# EAGLE design Vectr (EAGLE 6.3)

## Sheet 1 of 3: Analog
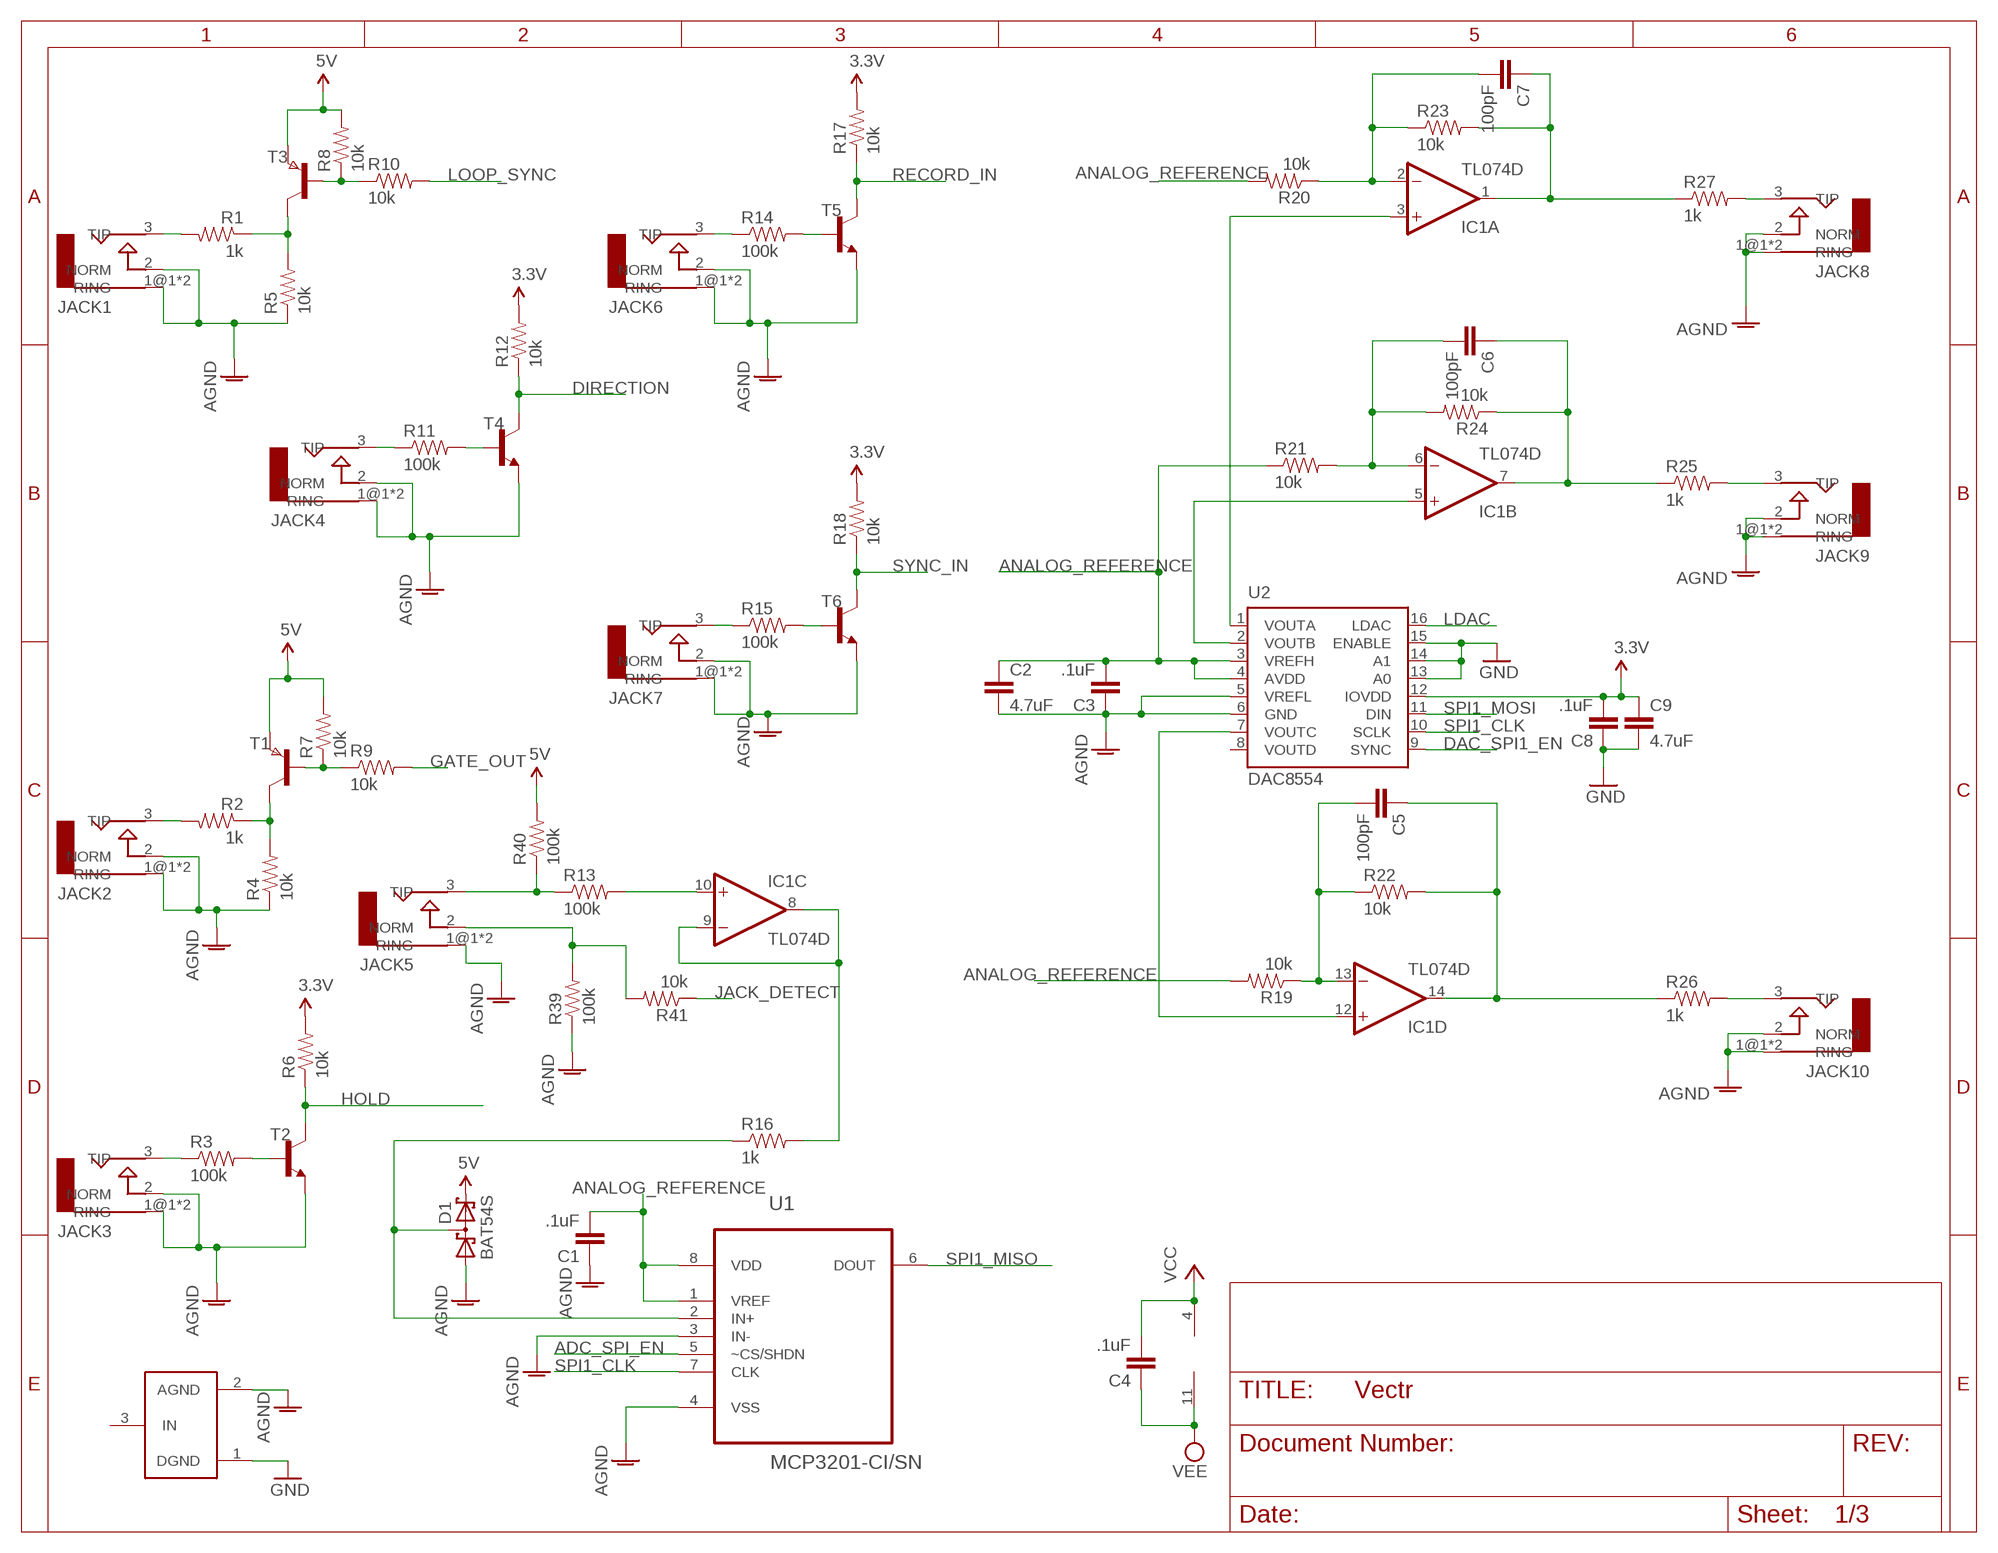
[diagram p0: schematic, sheet 1]

### Parts
C1  .1uF  CAP0402-CAP  [0402-CAP]
C2  4.7uF  CAP0805  [0805]
C3  .1uF  CAP0402-CAP  [0402-CAP]
C4  .1uF  CAP0402-CAP  [0402-CAP]
C5  100pF  CAP0402-CAP  [0402-CAP]
C6  100pF  CAP0402-CAP  [0402-CAP]
C7  100pF  CAP0402-CAP  [0402-CAP]
C8  .1uF  CAP0402-CAP  [0402-CAP]
C9  4.7uF  CAP0805  [0805]
D1  BAT54S  [SOT23]
GND_CONNECT  GND_CONNECT  [GND_CONNECT]
IC1  TL074D  [SO14]
JACK1  AUDIO-JACKERTHENVAR  [ERTHENVAR-JACK]
JACK2  AUDIO-JACKERTHENVAR  [ERTHENVAR-JACK]
JACK3  AUDIO-JACKERTHENVAR  [ERTHENVAR-JACK]
JACK4  AUDIO-JACKERTHENVAR  [ERTHENVAR-JACK]
JACK5  AUDIO-JACKERTHENVAR  [ERTHENVAR-JACK]
JACK6  AUDIO-JACKERTHENVAR  [ERTHENVAR-JACK]
JACK7  AUDIO-JACKERTHENVAR  [ERTHENVAR-JACK]
JACK8  AUDIO-JACKERTHENVAR  [ERTHENVAR-JACK]
JACK9  AUDIO-JACKERTHENVAR  [ERTHENVAR-JACK]
JACK10  AUDIO-JACKERTHENVAR  [ERTHENVAR-JACK]
R1  1k  RESISTOR0402-RES  [0402-RES]
R2  1k  RESISTOR0402-RES  [0402-RES]
R3  100k  RESISTOR0402-RES  [0402-RES]
R4  10k  RESISTOR0402-RES  [0402-RES]
R5  10k  RESISTOR0402-RES  [0402-RES]
R6  10k  RESISTOR0402-RES  [0402-RES]
R7  10k  RESISTOR0402-RES  [0402-RES]
R8  10k  RESISTOR0402-RES  [0402-RES]
R9  10k  RESISTOR0402-RES  [0402-RES]
R10  10k  RESISTOR0402-RES  [0402-RES]
R11  100k  RESISTOR0402-RES  [0402-RES]
R12  10k  RESISTOR0402-RES  [0402-RES]
R13  100k  RESISTOR0402-RES  [0402-RES]
R14  100k  RESISTOR0402-RES  [0402-RES]
R15  100k  RESISTOR0402-RES  [0402-RES]
R16  1k  RESISTOR0402-RES  [0402-RES]
R17  10k  RESISTOR0402-RES  [0402-RES]
R18  10k  RESISTOR0402-RES  [0402-RES]
R19  10k  RESISTOR0402-RES  [0402-RES]
R20  10k  RESISTOR0402-RES  [0402-RES]
R21  10k  RESISTOR0402-RES  [0402-RES]
R22  10k  RESISTOR0402-RES  [0402-RES]
R23  10k  RESISTOR0402-RES  [0402-RES]
R24  10k  RESISTOR0402-RES  [0402-RES]
R25  1k  RESISTOR0402-RES  [0402-RES]
R26  1k  RESISTOR0402-RES  [0402-RES]
R27  1k  RESISTOR0402-RES  [0402-RES]
R39  100k  RESISTOR0402-RES  [0402-RES]
R40  100k  RESISTOR0402-RES  [0402-RES]
R41  10k  RESISTOR0402-RES  [0402-RES]
T1  PNPSOT23  [SOT-23]
T2  TRANSISTOR_NPNSOT23  [SOT23]
T3  PNPSOT23  [SOT-23]
T4  TRANSISTOR_NPNSOT23  [SOT23]
T5  TRANSISTOR_NPNSOT23  [SOT23]
T6  TRANSISTOR_NPNSOT23  [SOT23]
U1  MCP3201-CI/SN  [SOIC127P600X175-8N]
U2  DAC8554  [PW_R-PDSO-G16]

### Nets
3.3V: C8.2 C9.1 R6.2 R12.2 R17.2 R18.2 U2.12(IOVDD) ; also sheet 2,3
5V: D1.2(C2) R7.2 R8.2 R40.2 T1.2(E) T3.2(E) ; also sheet 2
ADC_SPI_EN: U1.5(~CS/SHDN) ; also sheet 3
AGND: C1.1 C2.2 C3.1 D1.1(A1) GND_CONNECT.2(AGND) JACK1.1@1(RING) JACK1.1@2(RING) JACK1.2(NORM) JACK2.1@1(RING) JACK2.1@2(RING) JACK2.2(NORM) JACK3.1@1(RING) JACK3.1@2(RING) JACK3.2(NORM) JACK4.1@1(RING) JACK4.1@2(RING) JACK4.2(NORM) JACK5.1@1(RING) JACK5.1@2(RING) JACK6.1@1(RING) JACK6.1@2(RING) JACK6.2(NORM) JACK7.1@1(RING) JACK7.1@2(RING) JACK7.2(NORM) JACK8.1@1(RING) JACK8.1@2(RING) JACK8.2(NORM) JACK9.1@1(RING) JACK9.1@2(RING) JACK9.2(NORM) JACK10.1@1(RING) JACK10.1@2(RING) JACK10.2(NORM) R4.1 R5.1 R39.1 T2.2(E) T4.2(E) T5.2(E) T6.2(E) U1.3(IN-) U1.4(VSS) U2.5(VREFL) U2.6(GND) ; also sheet 2
ANALOG_REFERENCE: C1.2 C2.1 C3.2 R19.2 R20.2 R21.1 U1.1(VREF) U1.8(VDD) U2.3(VREFH) U2.4(AVDD) ; also sheet 2
DAC_SPI1_EN: U2.9(SYNC) ; also sheet 3
DIRECTION: R12.1 T4.3(C) ; also sheet 3
GATE_OUT: R9.2 ; also sheet 3
GND: C8.1 C9.2 GND_CONNECT.1(DGND) U2.13(A0) U2.14(A1) U2.15(ENABLE) ; also sheet 2,3
HOLD: R6.1 T2.3(C) ; also sheet 3
JACK_DETECT: R41.1 ; also sheet 3
LDAC: U2.16(LDAC) ; also sheet 3
LOOP_SYNC: R10.2 ; also sheet 3
N$1: R8.1 R10.1 T3.3(B)
N$2: C7.2 IC1.2(A:-IN) R20.1 R23.1
N$3: IC1.10(C:+IN) R13.2
N$4: C7.1 IC1.1(A:OUT) R23.2 R27.1
N$5: R1.1 R5.2 T3.1(C)
N$6: JACK1.3(TIP) R1.2
N$7: IC1.5(B:+IN) U2.2(VOUTB)
N$8: JACK4.3(TIP) R11.1
N$9: R11.2 T4.1(B)
N$10: IC1.8(C:OUT) IC1.9(C:-IN) R16.2
N$11: C6.2 IC1.6(B:-IN) R21.2 R24.2
N$12: R7.1 R9.1 T1.3(B)
N$13: R2.1 R4.2 T1.1(C)
N$14: JACK2.3(TIP) R2.2
N$15: C6.1 IC1.7(B:OUT) R24.1 R25.1
N$16: R3.2 T2.1(B)
N$18: JACK3.3(TIP) R3.1
N$19: C5.2 IC1.13(D:-IN) R19.1 R22.1
N$21: C5.1 IC1.14(D:OUT) R22.2 R26.1
N$22: JACK5.2(NORM) R39.2 R41.2
N$23: IC1.3(A:+IN) U2.1(VOUTA)
N$24: D1.3(C1A2) R16.1 U1.2(IN+)
N$25: JACK8.3(TIP) R27.2
N$26: JACK5.3(TIP) R13.1 R40.1
N$30: JACK6.3(TIP) R14.1
N$31: JACK9.3(TIP) R25.2
N$32: R14.2 T5.1(B)
N$34: IC1.12(D:+IN) U2.7(VOUTC)
N$38: JACK10.3(TIP) R26.2
N$39: JACK7.3(TIP) R15.1
N$40: R15.2 T6.1(B)
RECORD_IN: R17.1 T5.3(C) ; also sheet 3
SPI1_CLK: U1.7(CLK) U2.10(SCLK) ; also sheet 3
SPI1_MISO: U1.6(DOUT) ; also sheet 3
SPI1_MOSI: U2.11(DIN) ; also sheet 3
SYNC_IN: R18.1 T6.3(C) ; also sheet 3
VCC: C4.2 IC1.4(P:V+) ; also sheet 2
VEE: C4.1 IC1.11(P:V-) ; also sheet 2
Unconnected: GND_CONNECT.3(IN) U2.8(VOUTD)

## Sheet 2 of 3: Power
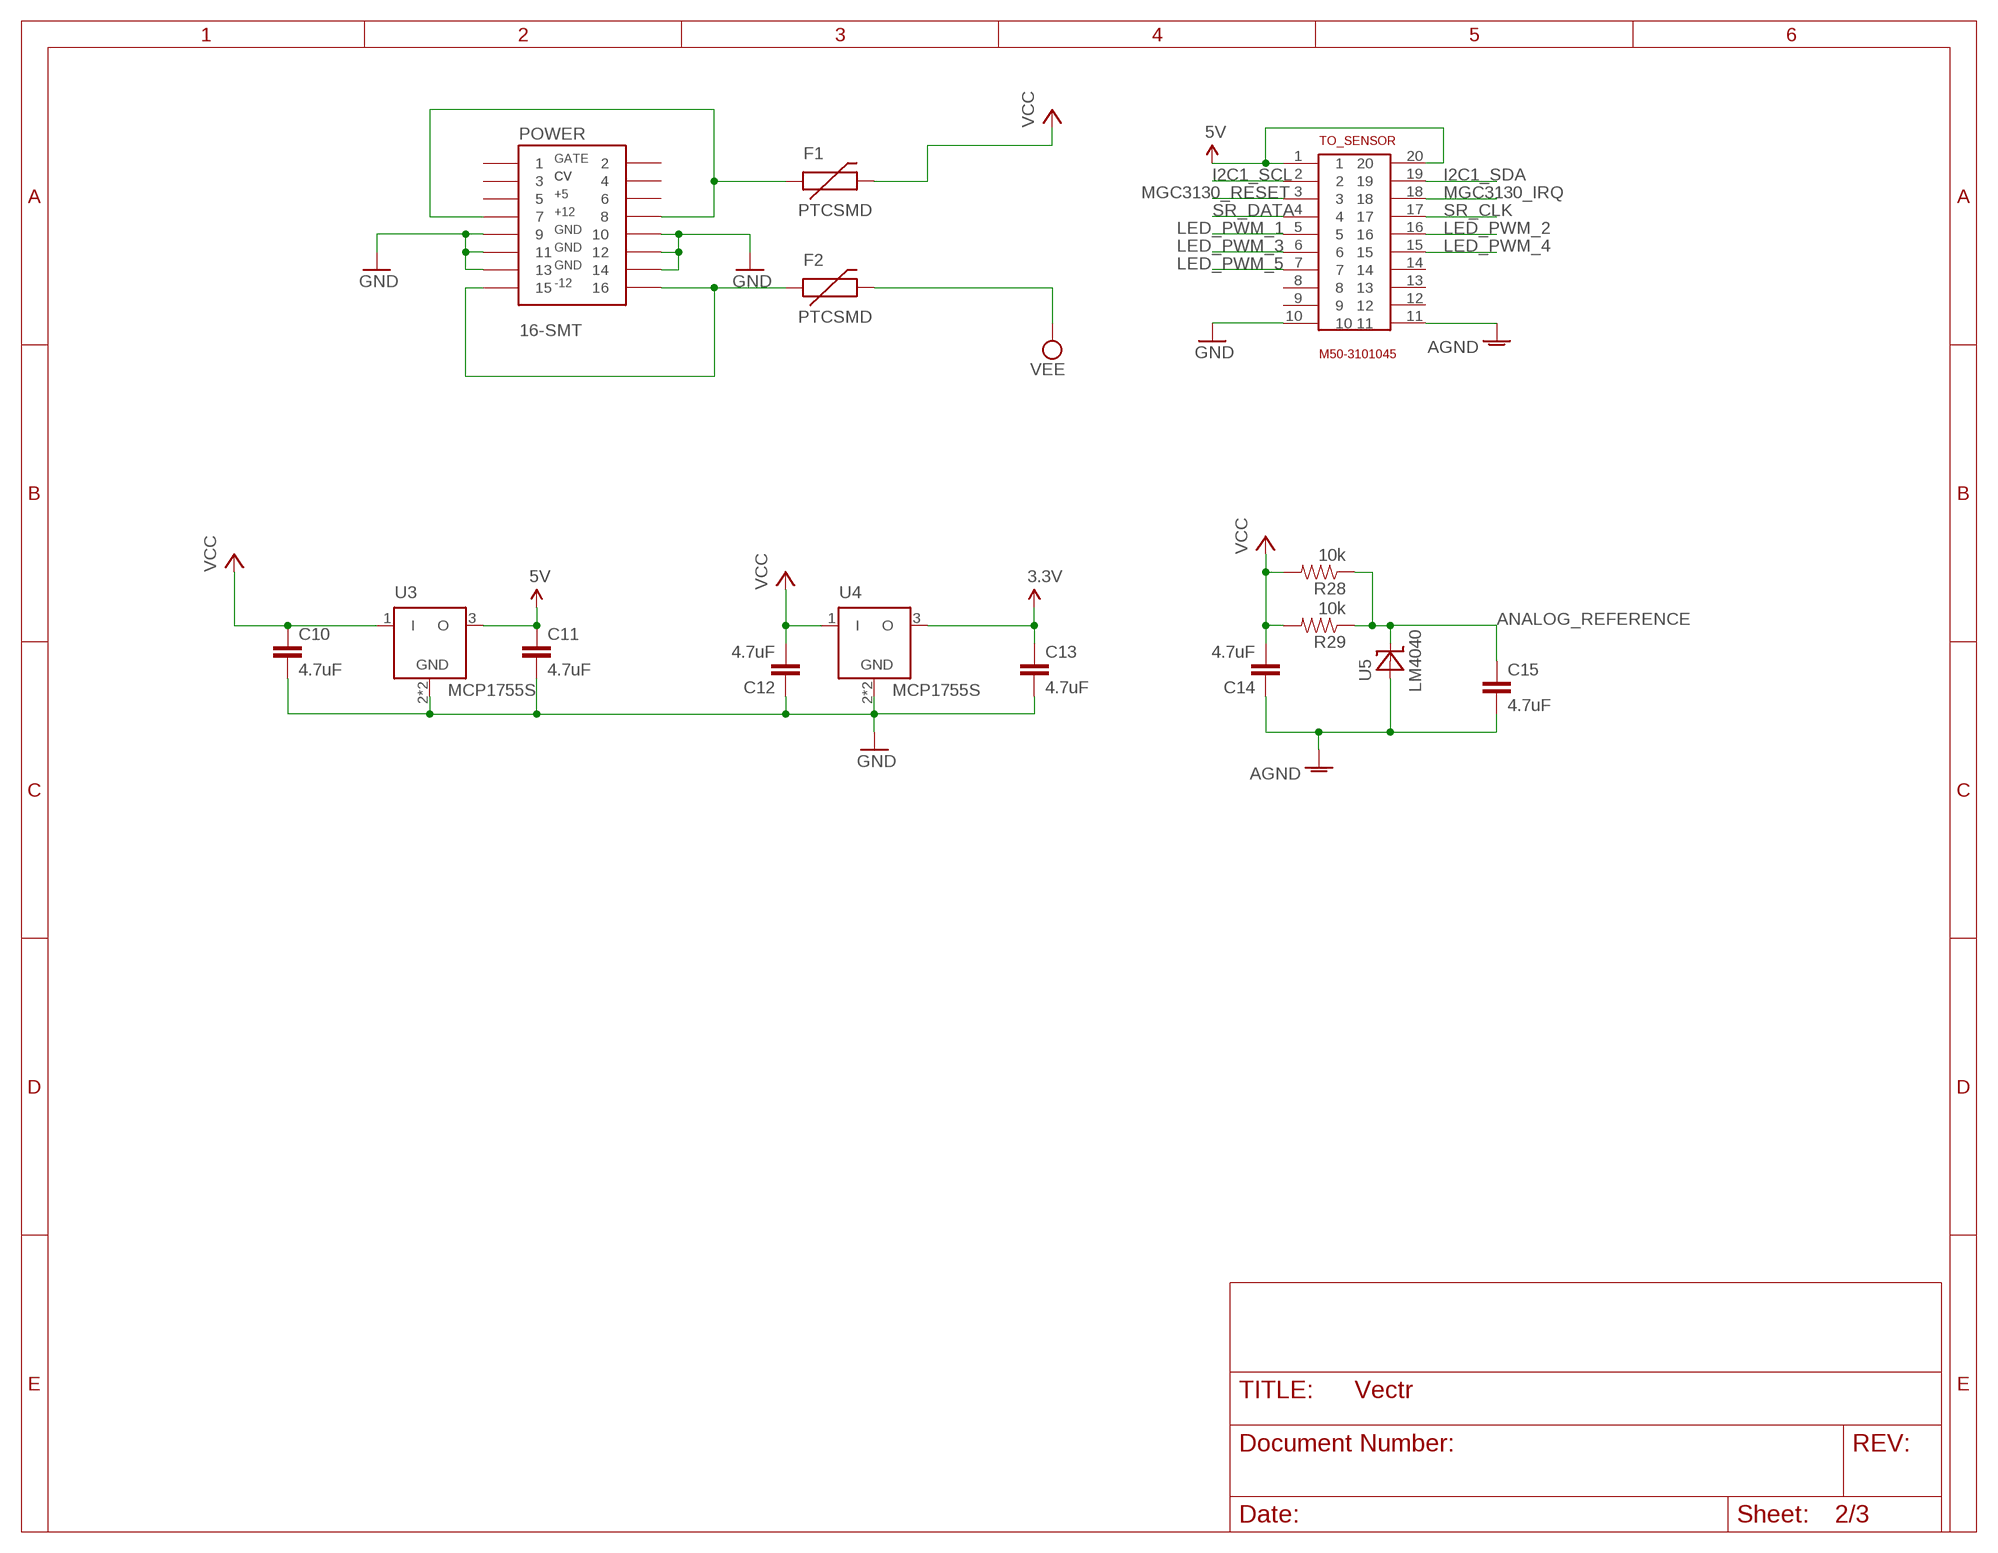
[diagram p1: schematic, sheet 2]

### Parts
C10  4.7uF  CAP0805  [0805]
C11  4.7uF  CAP0805  [0805]
C12  4.7uF  CAP0805  [0805]
C13  4.7uF  CAP0805  [0805]
C14  4.7uF  CAP0805  [0805]
C15  4.7uF  CAP0805  [0805]
F1  PTCSMD  [PTC-1206]
F2  PTCSMD  [PTC-1206]
POWER  16-SMT  [16-SMT]
R28  10k  RESISTOR0402-RES  [0402-RES]
R29  10k  RESISTOR0402-RES  [0402-RES]
TO_SENSOR  M50-3101045  [M50-3101045]
U3  MCP1755S  [SOT223]
U4  MCP1755S  [SOT223]
U5  LM4040  [SOT23]

### Nets
3.3V: C13.1 U4.3(O) ; also sheet 1,3
5V: C11.1 TO_SENSOR.1 TO_SENSOR.20 U3.3(O) ; also sheet 1
AGND: C14.1 C15.2 TO_SENSOR.11 U5.2(A) ; also sheet 1
ANALOG_REFERENCE: C15.1 R28.1 R29.1 U5.3(C) ; also sheet 1
GND: C10.2 C11.2 C12.1 C13.2 POWER.P$9 POWER.P$10 POWER.P$11 POWER.P$12 POWER.P$13 POWER.P$14 TO_SENSOR.10 U3.2(GND) U3.4(GND) U4.2(GND) U4.4(GND) ; also sheet 1,3
I2C1_SCL: TO_SENSOR.2 ; also sheet 3
I2C1_SDA: TO_SENSOR.19 ; also sheet 3
LED_PWM_1: TO_SENSOR.5 ; also sheet 3
LED_PWM_2: TO_SENSOR.16 ; also sheet 3
LED_PWM_3: TO_SENSOR.6 ; also sheet 3
LED_PWM_4: TO_SENSOR.15 ; also sheet 3
LED_PWM_5: TO_SENSOR.7 ; also sheet 3
MGC3130_IRQ: TO_SENSOR.18 ; also sheet 3
MGC3130_RESET: TO_SENSOR.3 ; also sheet 3
N$42: F1.1 POWER.P$7 POWER.P$8
N$44: F2.1 POWER.P$15 POWER.P$16
SR_CLK: TO_SENSOR.17 ; also sheet 3
SR_DATA: TO_SENSOR.4 ; also sheet 3
VCC: C10.1 C12.2 C14.2 F1.2 R28.2 R29.2 U3.1(I) U4.1(I) ; also sheet 1
VEE: F2.2 ; also sheet 1
Unconnected: POWER.P$1 POWER.P$2 POWER.P$3 POWER.P$4 POWER.P$5 POWER.P$6 TO_SENSOR.8 TO_SENSOR.9 TO_SENSOR.12 TO_SENSOR.13 TO_SENSOR.14

## Sheet 3 of 3: PIC32
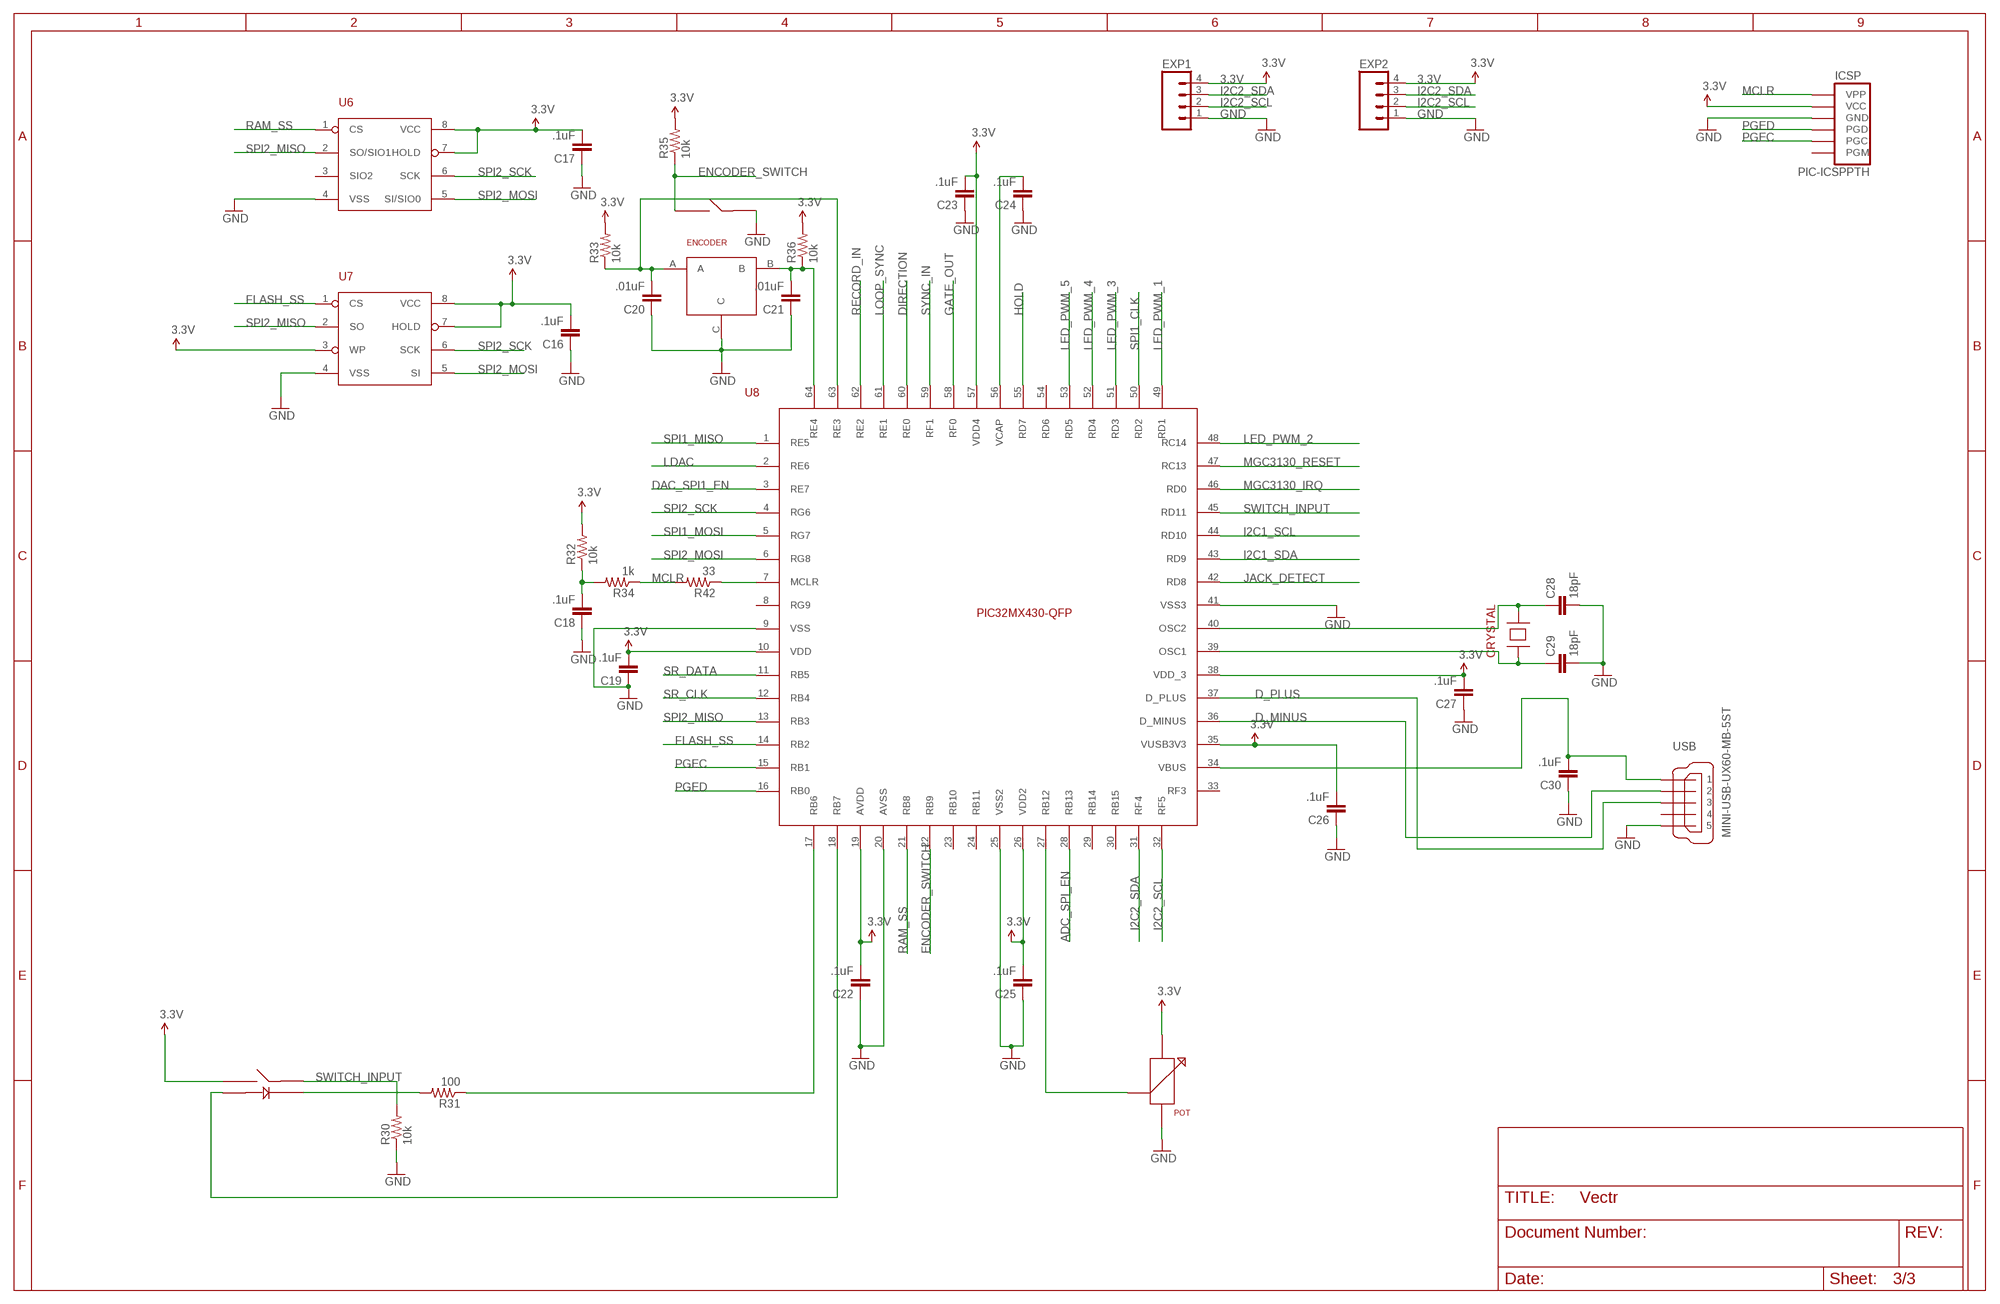
[diagram p2: schematic, sheet 3]

### Parts
C16  .1uF  CAP0402-CAP  [0402-CAP]
C17  .1uF  CAP0402-CAP  [0402-CAP]
C18  .1uF  CAP0402-CAP  [0402-CAP]
C19  .1uF  CAP0402-CAP  [0402-CAP]
C20  .01uF  CAP0402-CAP  [0402-CAP]
C21  .01uF  CAP0402-CAP  [0402-CAP]
C22  .1uF  CAP0402-CAP  [0402-CAP]
C23  .1uF  CAP0402-CAP  [0402-CAP]
C24  .1uF  CAP0402-CAP  [0402-CAP]
C25  .1uF  CAP0402-CAP  [0402-CAP]
C26  .1uF  CAP0402-CAP  [0402-CAP]
C27  .1uF  CAP0402-CAP  [0402-CAP]
C28  18pF  CAP0402-CAP  [0402-CAP]
C29  18pF  CAP0402-CAP  [0402-CAP]
C30  .1uF  CAP0402-CAP  [0402-CAP]
CRYSTAL  SMD-4-CRYSTAL  [SMD-4-CRYSTAL]
ENCODER  PEC16_ENCODER  [PEC16_ENCODER]
EXP1  M04SMD_STRAIGHT_COMBO  [1X04_SMD_STRAIGHT_COMBO]
EXP2  M04SMD_STRAIGHT_COMBO  [1X04_SMD_STRAIGHT_COMBO]
ICSP  PIC-ICSPPTH  [MOLEX-1X6]
POT  9MMPOT  [9MMPOT]
R30  10k  RESISTOR0402-RES  [0402-RES]
R31  100  RESISTOR0402-RES  [0402-RES]
R32  10k  RESISTOR0402-RES  [0402-RES]
R33  10k  RESISTOR0402-RES  [0402-RES]
R34  1k  RESISTOR0402-RES  [0402-RES]
R35  10k  RESISTOR0402-RES  [0402-RES]
R36  10k  RESISTOR0402-RES  [0402-RES]
R42  33  RESISTOR0402-RES  [0402-RES]
SWITCH  5GSH9  [5GSH9]
U6  23LC512  [SO-08]
U7  SST25VF010A  [SO-08]
U8  PIC32MX430-QFP  [QFP50P1200X1200X120-64N]
USB  MINI-USB-UX60-MB-5ST  [UX60-MB-5ST]

### Nets
3.3V: C16.2 C17.2 C19.2 C22.2 C23.2 C25.2 C26.2 C27.2 EXP1.4 EXP2.4 ICSP.5(VCC) POT.1 R32.2 R33.2 R35.2 R36.2 SWITCH.1 U6.7(HOLD) U6.8(VCC) U7.3(WP) U7.7(HOLD) U7.8(VCC) U8.10(VDD) U8.19(AVDD) U8.26(VDD2) U8.35(VUSB3V3) U8.38(VDD_3) U8.57(VDD4) ; also sheet 1,2
ADC_SPI_EN: U8.28(RB13) ; also sheet 1
D_MINUS: U8.36(D_MINUS) USB.2
D_PLUS: U8.37(D_PLUS) USB.3
DAC_SPI1_EN: U8.3(RE7) ; also sheet 1
DIRECTION: U8.60(RE0) ; also sheet 1
ENCODER_SWITCH: ENCODER.D R35.1 U8.22(RB9)
FLASH_SS: U7.1(CS) U8.14(RB2)
GATE_OUT: U8.58(RF0) ; also sheet 1
GND: C16.1 C17.1 C18.1 C19.1 C20.1 C21.1 C22.1 C23.1 C24.1 C25.1 C26.1 C27.1 C28.2 C29.2 C30.1 ENCODER.C ENCODER.E EXP1.1 EXP2.1 ICSP.4(GND) POT.3 R30.1 U6.4(VSS) U7.4(VSS) U8.9(VSS) U8.20(AVSS) U8.25(VSS2) U8.41(VSS3) USB.5 ; also sheet 1,2
HOLD: U8.55(RD7) ; also sheet 1
I2C1_SCL: U8.44(RD10) ; also sheet 2
I2C1_SDA: U8.43(RD9) ; also sheet 2
I2C2_SCL: EXP1.2 EXP2.2 U8.32(RF5)
I2C2_SDA: EXP1.3 EXP2.3 U8.31(RF4)
JACK_DETECT: U8.42(RD8) ; also sheet 1
LDAC: U8.2(RE6) ; also sheet 1
LED_PWM_1: U8.49(RD1) ; also sheet 2
LED_PWM_2: U8.48(RC14) ; also sheet 2
LED_PWM_3: U8.51(RD3) ; also sheet 2
LED_PWM_4: U8.52(RD4) ; also sheet 2
LED_PWM_5: U8.53(RD5) ; also sheet 2
LOOP_SYNC: U8.61(RE1) ; also sheet 1
MCLR: ICSP.6(VPP) R34.1 R42.2
MGC3130_IRQ: U8.46(RD0) ; also sheet 2
MGC3130_RESET: U8.47(RC13) ; also sheet 2
N$17: C18.2 R32.1 R34.2
N$20: C21.2 ENCODER.B R36.1 U8.64(RE4)
N$29: C20.2 ENCODER.A R33.1 U8.63(RE3)
N$33: POT.2 U8.27(RB12)
N$35: SWITCH.3 U8.18(RB7)
N$41: C28.1 CRYSTAL.3 U8.40(OSC2)
N$43: C29.1 CRYSTAL.1 U8.39(OSC1)
N$45: C30.2 U8.34(VBUS) USB.1
N$46: C24.2 U8.56(VCAP)
N$51: R31.2 SWITCH.2
PGEC: ICSP.2(PGC) U8.15(RB1)
PGED: ICSP.3(PGD) U8.16(RB0)
RAM_SS: U6.1(CS) U8.21(RB8)
RECORD_IN: U8.62(RE2) ; also sheet 1
RESET: R42.1 U8.7(MCLR)
SPI1_CLK: U8.50(RD2) ; also sheet 1
SPI1_MISO: U8.1(RE5) ; also sheet 1
SPI1_MOSI: U8.5(RG7) ; also sheet 1
SPI2_MISO: U6.2(SO/SIO1) U7.2(SO) U8.13(RB3)
SPI2_MOSI: U6.5(SI/SIO0) U7.5(SI) U8.6(RG8)
SPI2_SCK: U6.6(SCK) U7.6(SCK) U8.4(RG6)
SR_CLK: U8.12(RB4) ; also sheet 2
SR_DATA: U8.11(RB5) ; also sheet 2
SWITCH_INPUT: R30.2 SWITCH.4 U8.45(RD11)
SWITCH_LED1: R31.1 U8.17(RB6)
SYNC_IN: U8.59(RF1) ; also sheet 1
Unconnected: ICSP.1(PGM) U6.3(SIO2) U8.8(RG9) U8.23(RB10) U8.24(RB11) U8.29(RB14) U8.30(RB15) U8.33(RF3) U8.54(RD6) USB.4

## Library data of the parts
C1 C3-C8 C12 C14 C16-C30 = SparkFun-Passives:CAP: Capacitor Standard 0603 ceramic capacitor, and 0.1" leaded capacitor.
C2 C9-C11 C13 C15 = SparkFun-Capacitors:CAP: Capacitor Standard 0603 ceramic capacitor, and 0.1" leaded capacitor.
CRYSTAL = HackMe:SMD-4-CRYSTAL
D1 = diode:BAT54S: Schottky Diodes Pin connection corrected 2011-05-04 Source: Fairchild .. BAT54.pdf
ENCODER = HackMe:PEC16_ENCODER
EXP1 EXP2 = SparkFun-Connectors:M04: Header 4 Standard 4-pin 0.1" header. Use with straight break away headers (SKU : PRT-00116), right angle break away headers (PRT-00553), swiss pins (PRT-00743), machine pins (PRT-00117), and female headers (PRT-00115). Molex polarized connector foot print use with SKU : PRT-08231 with associated crimp pins and housings. 1MM SMD Version SKU: PRT-10208
F1 F2 = SparkFun-PowerIC:PTC: Resettable Fuse PTC Resettable Fuse. Spark Fun Electronics SKU : COM-08357
GND_CONNECT = SparkFun-Passives:GND_CONNECT: Use to make a connection of multiple grounds in only one place.
IC1 = linear:TL074: OP AMP
ICSP = SparkFun-Connectors:PIC-ICSP: ISCP Programming connector for UAV, UBW Kit, etc.
JACK1-JACK10 = erthenvar:AUDIO-JACK: Switching Mono 3.5mm Audio Jack from Erthenvar.
POT = HackMe:9MMPOT
POWER = HackMe:16-SMT
R1-R36 R39-R42 = SparkFun-Passives:RESISTOR: Resistor Basic schematic elements and footprints for 0603, 1206, and PTH resistors.
SWITCH = HackMe:5GSH9
T1 T3 = zetex:PNPSOT23: PNP TRANSISTOR; MPN: DSS20200L-7; OC_FARNELL: unknown; OC_NEWARK: 25R4554
T2 T4-T6 = SparkFun-DiscreteSemi:TRANSISTOR_NPN: Generic NPN BJT. MMBT2222 is the common NPN we use. Double check against datasheet- not all devices are the same!
TO_SENSOR = HackMe:M50-3101045
U1 = Microchip_By_element14_Batch_1:MCP3201-CI/SN: 12Bit A/D Converter; MPN: MCP3201-CI/SN; OC_FARNELL: 3167240; OC_NEWARK: 73K1001; PACKAGE: SOIC-8; SUPPLIER: Microchip
U2 = HackMe:DAC8554: 16 bit 4 channel DAC
U3 U4 = HackMe:MCP1755S
U5 = HackMe:LM4040
U6 = HackMe:23LC512: SPI SRAM 512kbit
U7 = HackMe:SST25VF010A
U8 = HackMe:PIC32MX430-QFP
USB = con-hirose:MINI-USB-: MINI USB Connector Source: http://www.hirose.co.jp/cataloge_hp/e24000019.pdf; OC_FARNELL: unknown; OC_NEWARK: unknown

## Board
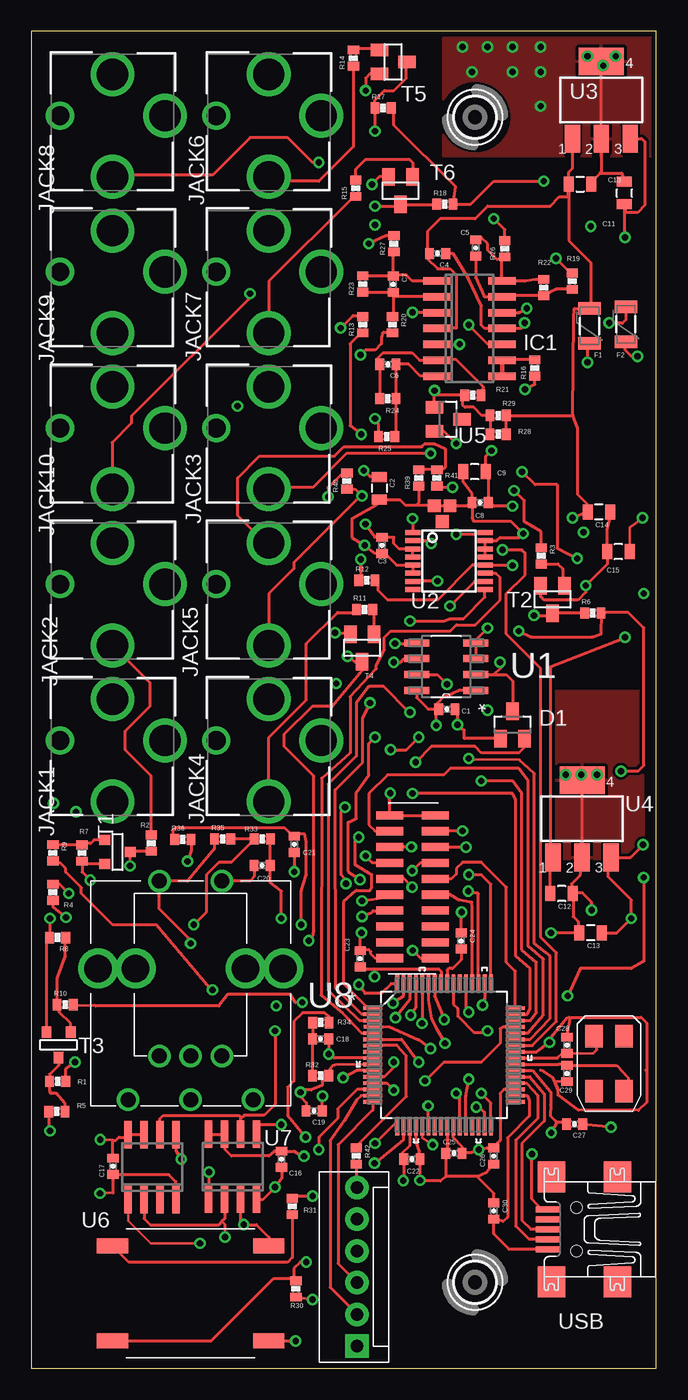
[diagram p3: board, top side]
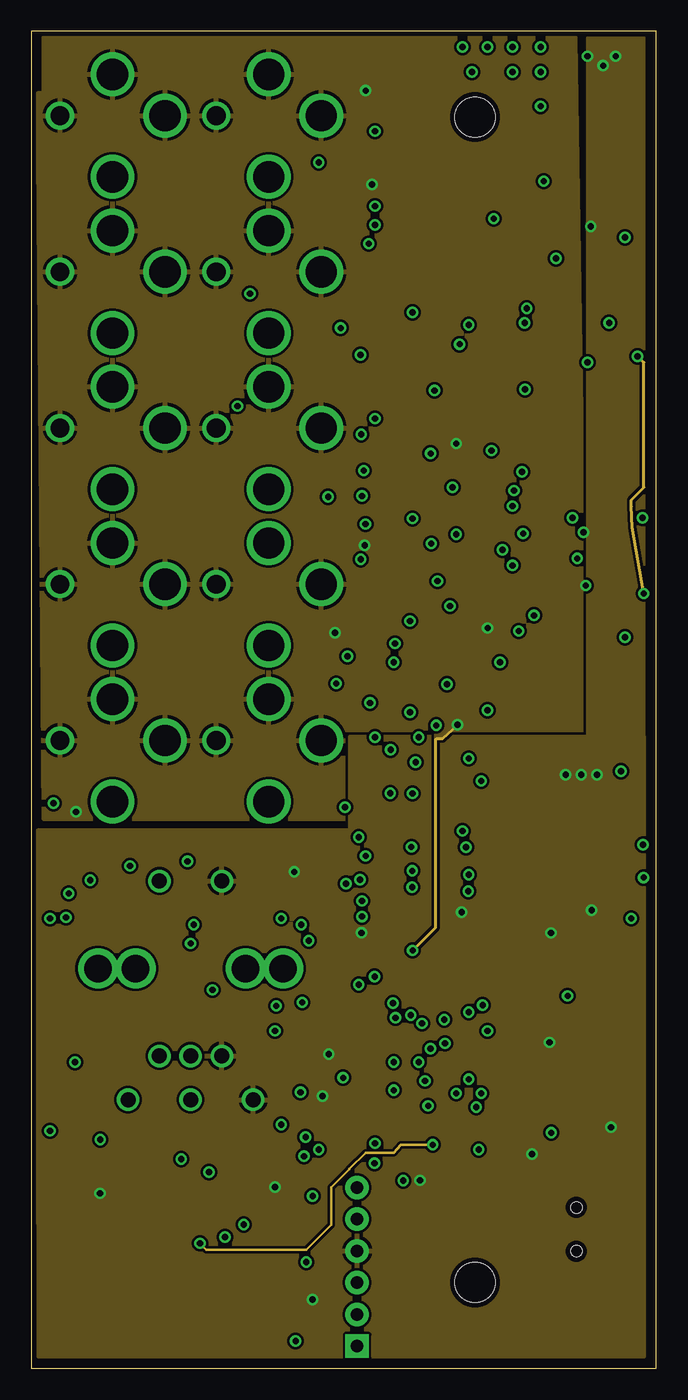
[diagram p4: board, inner layer Route2]
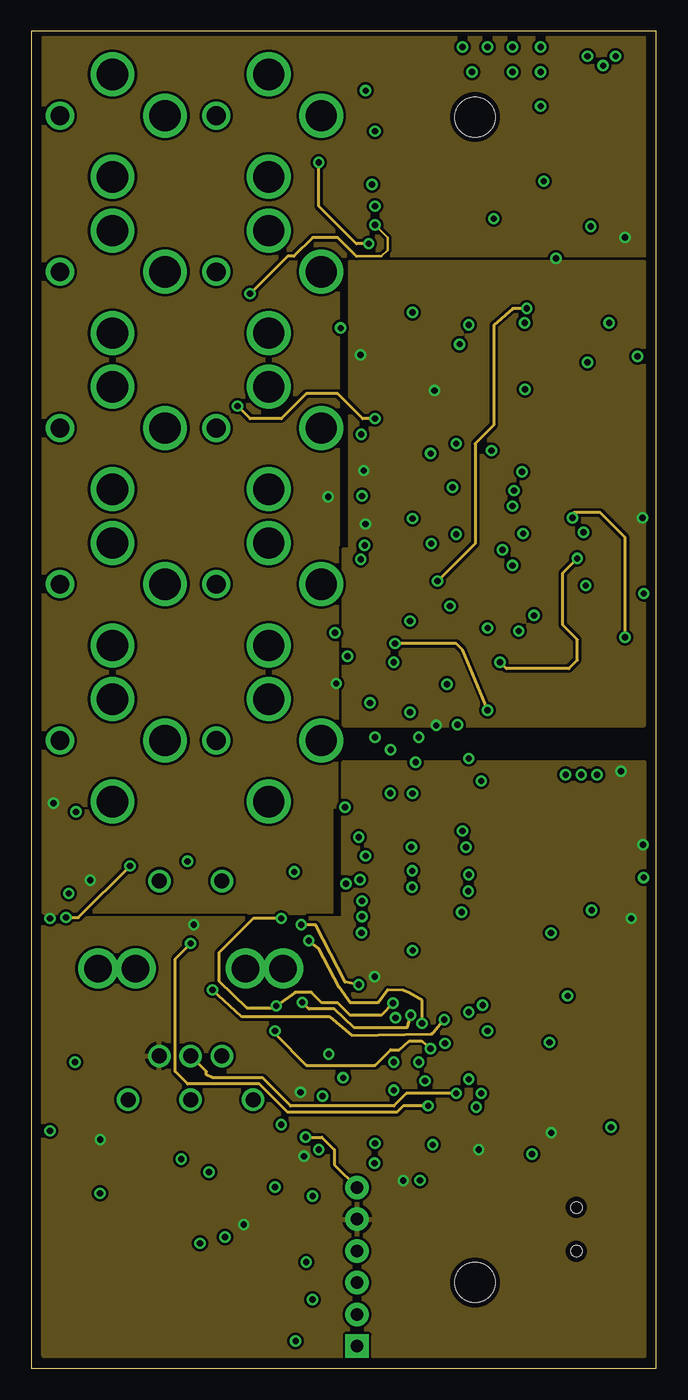
[diagram p5: board, inner layer Route15]
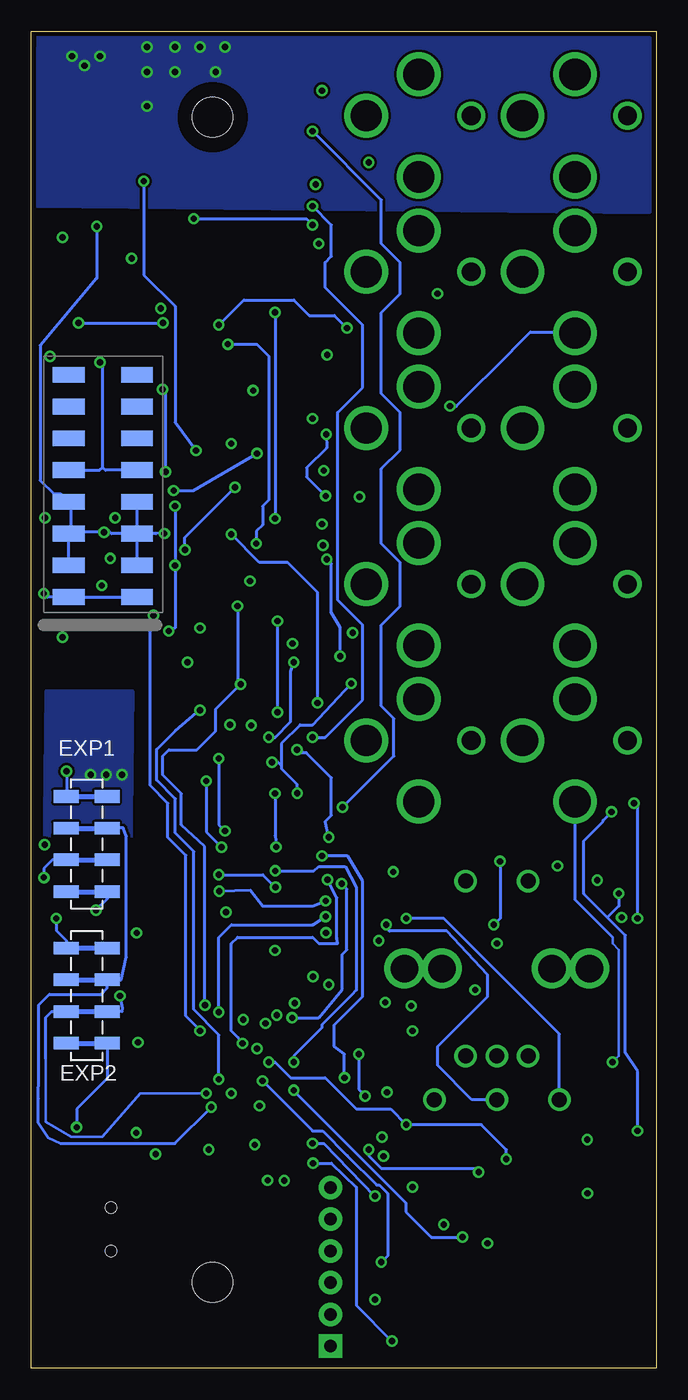
[diagram p6: board, bottom side, seen from below]

Size 50 x 107 mm. Coordinates in mm from the lower left corner, seen from the top.
Outline: 0,0 50,0 50,107 0,107 0,0
Copper layers (1*2+15*16): Top 0.035mm / dielectric 1.5mm / Route2 0.035mm / dielectric 0.15mm / Route15 0.035mm / dielectric 0.2mm / Bottom 0.035mm
Design rules "default *": minimum track width 8mil, minimum drill 15mil, track to track 8mil, track to pad 8mil, pad to pad 8mil, via to via 8mil, smd to smd 8mil, copper to edge 15mil, drill to drill 8mil, minimum pad ring 10mil, minimum via ring 8mil, stop-mask expansion 4mil, vias tented up to drill 0.45mm, thermal gap 10mil

### Footprints (pad centres in the part's own frame; a part is rotated, then mirrored left to right if it is on the bottom)
0402-CAP = smd 0.7 x 0.9: 1 -0.65,0; 2 0.65,0
0805 = smd 0.8 x 1.2: 1 -0.9,0; 2 0.9,0
SMD-4-CRYSTAL = smd 1.803 x 1.397: 1 -2.197,-1.194; 2 2.197,-1.194; 3 2.197,1.194; 4 -2.197,1.194
SOT23 = smd 1 x 1.4: 1 -0.95,-1.1; 2 0.95,-1.1; 3 0,1.1
PEC16_ENCODER = drill 1.2: A -5,-10.5; B 0,-10.5; C 5,-10.5; D -2.5,7; E 2.5,7 | drill 2.2: P$6 -7.4,0; P$7 7.4,0
1X04_SMD_STRAIGHT_COMBO = smd 1 x 2: 1 0,-1.65; 1-2 0,1.65; 2 2.54,1.65; 2-2 2.54,-1.65; 3 5.08,-1.65; 3-2 5.08,1.65; 4 7.62,1.65; 4-2 7.62,-1.65
PTC-1206 = smd 1 x 1.8: 1 -1.4,0; 2 1.4,0
GND_CONNECT = smd 1.016 x 1.016: 1 -1.016,0; 2 -1.016,-1.27; 3 0.254,-0.635
SO14 = smd 0.6 x 2.2: 1 -3.81,-2.6; 2 -2.54,-2.6; 3 -1.27,-2.6; 4 0,-2.6; 5 1.27,-2.6; 6 2.54,-2.6; 7 3.81,-2.6; 8 3.81,2.6; 9 2.54,2.6; 10 1.27,2.6; 11 0,2.6; 12 -1.27,2.6; 13 -2.54,2.6; 14 -3.81,2.6
MOLEX-1X6 = drill 1.016 pad 1.88 square: 1 0,0 | drill 1.016 pad 1.88: 2 2.54,0; 3 5.08,0; 4 7.62,0; 5 10.16,0; 6 12.7,0
ERTHENVAR-JACK = drill 2.5: 1@1 -4.2,0; 2 0,-3.3; 3 0,4.9 | drill 1.5: 1@2 4.2,0
9MMPOT = drill 1.2: 1 -2.5,-7; 2 0,-7; 3 2.5,-7 | drill 2.2: P$4 -4.4,0; P$5 4.4,0
16-SMT = smd 1.27 x 2.54: P$1 0,0; P$2 0,5.46; P$3 2.54,0; P$4 2.54,5.46; P$5 5.08,0; P$6 5.08,5.46; P$7 7.62,0; P$8 7.62,5.46; P$9 10.16,0; P$10 10.16,5.46; P$11 12.7,0; P$12 12.7,5.46; P$13 15.24,0; P$14 15.24,5.46; P$15 17.78,0; P$16 17.78,5.46
0402-RES = smd 0.7 x 0.9: 1 -0.65,0; 2 0.65,0
5GSH9 = smd 2.5 x 1.2: 1 6.25,3.81; 2 -6.25,3.81; 3 6.25,-3.81; 4 -6.25,-3.81
SOT-23 = smd 0.787 x 0.889: 1 0.025,-1.016; 2 -0.94,1.016; 3 0.991,1.016
M50-3101045 = smd 0.65 x 2.15: 1 0,-1.825; 2 1.27,-1.825; 3 2.54,-1.825; 4 3.81,-1.825; 5 5.08,-1.825; 6 6.35,-1.825; 7 7.62,-1.825; 8 8.89,-1.825; 9 10.16,-1.825; 10 11.43,-1.825; 11 11.43,1.825; 12 10.16,1.825; 13 8.89,1.825; 14 7.62,1.825; 15 6.35,1.825; 16 5.08,1.825; 17 3.81,1.825; 18 2.54,1.825; 19 1.27,1.825; 20 0,1.825
SOIC127P600X175-8N = smd 1.981 x 0.559: 1 -2.362,1.905; 2 -2.362,0.635; 3 -2.362,-0.635; 4 -2.362,-1.905; 5 2.362,-1.905; 6 2.362,-0.635; 7 2.362,0.635; 8 2.362,1.905
PW_R-PDSO-G16 = smd 0.4 x 1.2: 1 -2.275,-2.9; 2 -1.625,-2.9; 3 -0.975,-2.9; 4 -0.325,-2.9; 5 0.325,-2.9; 6 0.975,-2.9; 7 1.625,-2.9; 8 2.275,-2.9; 9 2.275,2.9; 10 1.625,2.9; 11 0.975,2.9; 12 0.325,2.9; 13 -0.325,2.9; 14 -0.975,2.9; 15 -1.625,2.9; 16 -2.275,2.9
SOT223 = smd 1.219 x 2.235: 1 -2.311,-3.099; 2 0,-3.099; 3 2.311,-3.099 | smd 3.6 x 2.2: 4 0,3.099
SOT23' = smd 1 x 1.4: 1 0,1.1; 2 0.95,-1.1; 3 -0.95,-1.1
SO-08 = smd 0.6 x 2.2: 1 -1.905,-2.6; 2 -0.635,-2.6; 3 0.635,-2.6; 4 1.905,-2.6; 5 1.905,2.6; 6 0.635,2.6; 7 -0.635,2.6; 8 -1.905,2.6
QFP50P1200X1200X120-64N = smd 1.5 x 0.3: 1 -5.7,3.75; 2 -5.7,3.25; 3 -5.7,2.75; 5 -5.7,1.75; 6 -5.7,1.25; 7 -5.7,0.75; 8 -5.7,0.25; 9 -5.7,-0.25; 10 -5.7,-0.75; 11 -5.7,-1.25; 12 -5.7,-1.75; 13 -5.7,-2.25; 14 -5.7,-2.75; 15 -5.7,-3.25; 16 -5.7,-3.75; 33 5.7,-3.75; 34 5.7,-3.25; 35 5.7,-2.75; 36 5.7,-2.25; 37 5.7,-1.75; 38 5.7,-1.25; 39 5.7,-0.75; 40 5.7,-0.25; 41 5.7,0.25; 42 5.7,0.75; 43 5.7,1.25; 44 5.7,1.75; 45 5.7,2.25; 46 5.7,2.75; 47 5.7,3.25; 48 5.7,3.75 | smd 1.473 x 0.279: 4 -5.7,2.25 | smd 0.3 x 1.5: 17 -3.75,-5.7; 18 -3.25,-5.7; 19 -2.75,-5.7; 20 -2.25,-5.7; 21 -1.75,-5.7; 22 -1.25,-5.7; 23 -0.75,-5.7; 24 -0.25,-5.7; 25 0.25,-5.7; 26 0.75,-5.7; 27 1.25,-5.7; 28 1.75,-5.7; 29 2.25,-5.7; 30 2.75,-5.7; 31 3.25,-5.7; 32 3.75,-5.7; 49 3.75,5.7; 50 3.25,5.7; 51 2.75,5.7; 52 2.25,5.7; 53 1.75,5.7; 54 1.25,5.7; 56 0.25,5.7; 57 -0.25,5.7; 58 -0.75,5.7; 59 -1.25,5.7; 60 -1.75,5.7; 61 -2.25,5.7; 62 -2.75,5.7; 63 -3.25,5.7; 64 -3.75,5.7 | smd 0.279 x 1.473: 55 0.75,5.7
3,2 = hole 3.2: 0,0
UX60-MB-5ST = smd 2 x 0.5: 1 2.25,1.6; 2 2.25,0.8; 3 2.25,0; 4 2.25,-0.8; 5 2.25,-1.6 | smd 2.2 x 2.5: M1 -3.3,-4.2; M2 -3.3,4.2; M3 2,4.2; M4 2,-4.2 | hole 0.9: 0,-1.75; 0,1.75

### Placement (x,y rotation side)
C1  33.25,52.75 180 top
C2  27.85,70.44 270 top
C3  28.05,65.86 90 top
C4  32.5,89.21 180 top
C5  35.56,89.65 270 top
C6  28.52,80.35 180 top
C7  28.95,86.75 270 top
C8  35.91,69.28 0 top
C9  35.47,71.75 180 top
C10  43.9,94.76 0 top
C11  47.44,94.04 90 top
C12  42.42,37.99 180 top
C13  44.74,34.85 180 top
C14  45.4,68.53 180 top
C15  46.97,65.35 180 top
C16  20.02,16.73 90 top
C17  6.54,16.17 90 top
C18  23.14,26.36 180 top
C19  22.63,20.6 180 top
C20  18.47,40.24 0 top
C21  21.04,41.93 90 top
C22  30.44,16.74 180 top
C23  26.31,32.77 270 top
C24  34.39,34.2 270 top
C25  33.81,17.21 0 top
C26  37,17 90 top
C27  43.47,19.55 180 top
C28  42.85,25.85 90 top
C29  42.85,23.6 270 top
C30  37,12.6 270 top
CRYSTAL  46.21,24.37 90 top
D1  38.5,51.5 0 top
ENCODER  12.75,32 0 top
EXP1  45.57,38.14 90 bottom
EXP2  45.57,26.01 90 bottom
F1  44.66,83.41 90 top
F2  47.57,83.55 90 top
GND_CONNECT  33.51,68.01 270 top
IC1  35.04,83.21 270 top
ICSP  26.07,1.77 90 top
JACK1  6.5,50.25 180 top
JACK2  6.5,62.75 180 top
JACK3  19,75.25 180 top
JACK4  19,50.25 180 top
JACK5  19,62.75 180 top
JACK6  19,100.25 180 top
JACK7  19,87.75 180 top
JACK8  6.5,100.25 180 top
JACK9  6.5,87.75 180 top
JACK10  6.5,75.25 180 top
POT  12.75,32 0 top
POWER  47,79.5 270 bottom
R1  2.11,22.96 0 top
R2  9.59,42.02 90 top
R3  40.79,65.02 270 top
R4  1.73,38.1 270 top
R5  2.05,20.55 0 top
R6  44.93,60.44 0 top
R7  4.06,41.24 270 top
R8  2.1,34.47 180 top
R9  1.73,41.25 270 top
R10  2.71,29.1 0 top
R11  26.66,60.73 0 top
R12  26.85,63.06 0 top
R13  26.52,83.51 90 top
R14  25.77,104.85 90 top
R15  25.95,94.43 90 top
R16  40.28,80.05 90 top
R17  28.14,100.86 0 top
R18  33.09,93.15 0 top
R19  43.27,86.99 90 top
R20  28.9,83.52 270 top
R21  35.33,77.87 0 top
R22  40.99,86.49 90 top
R23  26.51,86.77 90 top
R24  28.52,77.61 180 top
R25  28.43,74.57 180 top
R26  37.88,89.59 90 top
R27  29.01,89.98 90 top
R28  37.35,74.75 0 top
R29  37.35,76.25 0 top
R30  21.17,6.36 90 top
R31  20.88,12.95 270 top
R32  23.15,23.42 0 top
R33  18.48,42.37 180 top
R34  23.16,27.67 180 top
R35  15.31,42.35 0 top
R36  12.13,42.32 0 top
R39  31,71.25 90 top
R40  25.25,71 90 top
R41  32.45,71.25 90 top
R42  26,17 270 top
SWITCH  12.75,6 0 top
T1  6.9,41.29 90 top
T2  41.7,61.54 180 top
T3  2.16,25.88 0 top
T4  26.47,57.66 180 top
T5  28.94,104.54 270 top
T6  29.54,94.24 180 top
TO_SENSOR  30.5,44.25 270 top
U1  33.2,56.15 180 top
U2  33.41,64.6 270 top
U3  45.61,101.5 0 top
U4  44.06,43.98 0 top
U5  LM4040  [SOT23']  33.35,75.95 270 top
U6  9.66,16.11 0 top
U7  16.1,16.13 0 top
U8  33.02,25.08 0 top
U$3  [3,2]  35.5,100.12 0 top
U$5  [3,2]  35.5,6.88 0 top
USB  43.6,11.12 180 top

### Tracks (layer width: path | path; a pad name or v marks a point on that pad's centre or on a via)
3.3V  (via drill 0.5)
  Top 0.25: v36.82,73.44 36.37,72.99 C9.1 36.57,71.37 C8.2
  Top 0.254: U8.19 30.27,17.82 29.6,17.15 29.6,16.5 C22.2 29.79,15.07 29.56,15.04 v29.76,15.02 | 42.15,19.7 42.61,19.7 C27.2 | 42.15,19.7 42,19.6 v41.6,18.85 | C13.1 46.85,34.85 v48,36 48,37.48 46.17,39.31 46.17,40.88 U4.3 47.94,40.88 48.95,41.89 v48.94,41.9 v48.93,41.9 | U8.10 24.37,24.29 24.12,24.22 23.9,23.96 23.9,23.41 23.26,23.41 | 23.26,23.41 R32.2 | 23.26,23.41 23.26,22.63 22.41,22.28 21.73,22.28 v21.54,22.09 21.54,21.71 22,21.25 22,20.62 C19.2 | U7.3 16.73,11.77 v17,11.5 18,11.5 19,10.5 SWITCH.1 | U7.8 U7.7 15.5,18.7 15.5,17.5 16,17 19,17 19.43,17.38 C16.2 21.03,17.38 21.65,17.01 21.78,17.01 v21.82,16.97 21.8,16.97 21.78,16.95 | C17.2 6.54,18.26 | 6.54,18.26 5.52,18.28 v5.52,18.3 | 6.54,18.26 6.76,18.26 7,18.5 7.54,18.5 U6.8 U6.7 | R35.2 16.27,42.37 R33.2 17.63,42.13 16,40.5 15,40.5 14,39.5 14,36.5 v13,35.5 | R36.2 12.79,41.44 v12.5,40.57 | v39,59 40,58.54 44.86,58.54 45.57,58.75 R6.2 45.64,60.5 47.75,60.5 49,59.25 49,48.25 48.54,47.79 v47.18,47.79 | v41,95 37,95 35.15,93.15 R18.2 33.94,94.56 29,99.5 29,100.85 R17.2 | U8.38 40.1,23.83 41.55,22.12 41.55,21.12 41.53,20.2 41.93,19.82 42.15,19.7 | C23.2 26.67,32.08 26.79,31.96 27.38,31.96 | 27.38,31.96 32.59,31.96 32.78,31.77 U8.57 | 27.38,31.96 27.47,31.37 | 27.47,31.37 27.48,31.36 | v27.47,31.34 27.47,31.37 | v38.5,69 37.04,69 C8.2 | v38.5,64.25 38.48,64.28 U2.12 35.27,64.28 32.5,61.5 28.5,61.5 27.75,62.25 27.75,63.01 R12.2 | U8.26 33.75,19.36 33.75,18.5 34.46,17.74 C25.2 34.5,17.25 35.25,17.25 35.3,17.3 v35.8,17.5 36.45,17.65 C26.2 37.25,17.6 37.25,18 37.5,18.25 37.5,22 37.83,22.33 U8.35
  Bottom 0.254: v48,36 48,35.02 47.22,34.24 EXP2.4 | v47.18,47.79 47.18,45.8 EXP1.4 | v12.5,40.57 12.5,36 v13,35.5 | v38.5,69 v38.5,64.25 38.5,59.25 v39,59 | v41,95 41,87.5 38.5,85 38.5,75.72 v36.82,73.44
  pour Route15: 1,36 25,36 25,48.5 49,48.5 49,1 1,1
5V  (via drill 0.5)
  Top 0.254: TO_SENSOR.20 TO_SENSOR.1 28.68,45.98 v28.72,46.03 | U3.3 48.84,98.4 49.09,98.15 49.09,93.09 48.5,92.5 47.58,92.5 C11.1 47.44,90.56 v47.5,90.5 | 1.24,34.46 R8.2 | R8.2 1.5,34.8 v1.5,36 | T1.2 4.1,40.35 R7.2 4.06,39.72 v4.72,39.06 | D1.2 39.45,49.7 39,49.25 36,49.25 35.5,49.75 32,49.75 v30.75,48.5 | R40.2 24.9,71.65 23.75,70.5 v23.75,69.75 | T3.2 1.22,34.24 R8.2
  Bottom 0.254: v24.4,54.8 27.5,51.5 28.5,51.5 30,50 30,48.25 | v1.5,36 1.5,45 1.75,45.25 | v1.78,45.22 1.75,45.25 | v1.78,45.23 v1.78,45.22 | 1.75,45.25 1.75,45.26 | 1.75,45.25 1.75,45.19 1.79,45.19 1.79,45.2 1.81,45.18 | v1.78,45.22 1.78,45.21 1.8,45.21 1.8,45.18 | 30,48.25 30,48 28.75,46.75 28.75,46.06 v28.72,46.03 | v30.75,48.5 30.25,48.5 30,48.25
  pour Route15 (rank 2): 49,88 49,106.5 1,106.5 1,36.5 24,36.5 24,45 24.5,45 24.5,88
ADC_SPI_EN  (via drill 0.5)
  Top 0.254: U8.28 34.77,21.77 v35,23.13 | v29.1,58 30.78,58 U1.5
  Route15 0.254: v36.5,52.67 34.5,57.5 34,58 v29.1,58
  Bottom 0.254: v35,23.13 35,26.67 37.01,28.74 37,41.36 38.48,42.84 38.48,45.58 39.97,47.07 39.97,49.53 38.5,51 36.75,52.5 v36.5,52.67
AGND  (via drill 0.5)
  Top 0.25: 32.23,69.04 30.75,69.04 29.96,69.04 29.5,69.5 28.39,69.5 C2.2
  Top 0.254: D1.1 34.65,50.4 34.65,51.05 v34.1,51.5 34.1,52.55 C1.1 | R5.1 1.4,19.35 v1.5,19 | R4.1 2.05,38.95 v3,38 | U2.6 U2.5 29.23,64.28 28.5,65.01 C3.1 27.53,65.21 v26.68,65.86 v26.67,65.86 25.65,66.5 25.65,67.97 27.54,69.04 C2.2 | 33.5,69 33.47,69.03 GND_CONNECT.2 32.23,69.04 | C14.1 46.24,68.52 46.24,67.79 46.07,67.12 C15.2 46.07,64.35 v44.36,62.64 44.36,62.11 43.75,61.5 41,61.5 40.75,61.75 T2.2 | U1.3 U1.4 35.56,58.29 v36.51,59.24 | v30.51,33.44 30.55,33.44 31.17,32.82 TO_SENSOR.11 | U5.2 33,75 v34,74 | T5.2 27.09,103.59 26.75,103.25 v26.75,102.25 | T6.2 27.84,95.34 v27.25,94.75 | v24.29,58.86 25.42,58.86 T4.2 | R39.1 31,69.29 30.75,69.04
  Route2 0.254: v30.51,33.44 32.35,35.28 32.35,50.35 32.4,50.4 32.9,50.4 v34.1,51.5
  Bottom 0.254: v1.5,19 1.5,23.76 2.48,25.24 2.48,34.66 3.91,36.09 | 3.91,36.09 5.8,37.98 5.8,42.22 4.25,43.77 4.25,43.86 v3.58,44.53 | v3,38 3,37 3.91,36.09
  pour Route2 (rank 2): 1,44 44.5,44 43.5,106.5 1,106.5 1,102 0.5,102
ANALOG_REFERENCE  (via drill 0.5)
  Top 0.203: C15.1 47.87,67.28 v48.9,68.06 48.86,68.06
  Top 0.254: U2.4 U2.3 29.43,65.58 29,66 29,66.5 28.26,66.5 C3.2 | C3.2 28.21,66.71 | C3.2 27.47,66.51 v26.73,67.56 v26.74,67.56 | 26.64,71.85 v26.6,71.84 27.1,71.34 C2.1 | R20.2 28.12,82.87 28,82.5 28,82 27.5,81.5 26.72,81.5 v26.33,81.11 | R19.2 42.96,87.84 v41.97,88.83 | U5.3 v32.25,78.25 32.25,77.87 R21.1 34.5,77.85 34.5,77.1 34.7,76.9 35.4,76.9 36.05,76.25 R29.1 R28.1 | U1.8 30.84,53.66 31.75,52.75 C1.2 | U1.1 34.24,54.24 33.2,53.75 33,53.75 32.5,53.25 32.5,52.85 C1.2 | v32.4,51.45 32.4,52.55 C1.2
  pour Route15: 25,51.5 49,51.5 49,88.5 25.5,88.5 25.5,65.5 25,65.5
D_MINUS
  Top 0.254: U8.36 39.62,22.82 40.5,21.83 40.5,20 38.75,18.25 38.75,11.4 39.8,10.35 41.32,10.35 USB.2
D_PLUS
  Top 0.254: U8.37 39.88,23.33 41.05,21.95 41.05,19.8 39.25,18 39.25,11.85 39.95,11.15 41.32,11.15 USB.3
DAC_SPI1_EN  (via drill 0.5)
  Top 0.254: v30.3,59.8 33,59.8 33.5,60 34.59,60 36.3,61.71 U2.9 | v30.3,52.5 30.25,52.5 28.2,54.55 27,54.55 26,53.25 26,49 23.75,46.75 23.75,30.25 26.25,27.85 27.24,27.85 U8.3
  Bottom 0.254: v30.3,52.5 v30.3,59.8
DIRECTION  (via drill 0.5)
  Top 0.254: U8.60 v31.27,27.6 | v22.2,34.21 22.51,34.58 22.61,34.97 22.61,47.39 20.25,49.75 20.25,50.75 22.5,53 24.08,53 26.47,55.89 T4.3 26.14,56.36 v25.29,56.99 | v26.36,64.74 26.36,63.42 R12.1
  Route15 0.254: v31.27,27.6 31.26,29.44 30.25,30.05 29.75,30.25 28.5,30.3 27.75,29.25 25.5,29.25 24.65,30.5 22.99,33.6 v22.2,34.21
  Bottom 0.254: v25.29,56.99 25.29,59.29 26,60.5 26,64.38 v26.36,64.74
ENCODER_SWITCH  (via drill 0.5)
  Top 0.254: R35.1 14.65,41.55 12.5,39 ENCODER.D 10.25,36.75 12.75,34.25 v12.75,34 | U8.22 31.77,20.98 v31.75,21
  Route15 0.254: v31.75,21 29.75,21 29.25,20.5 20.5,20.5 18.25,22.75 12.5,22.75 11.5,23.75 11.5,32.75 v12.75,34
FLASH_SS  (via drill 0.5)
  Top 0.254: U7.1 14.21,13.54 v14.21,15.71 | U8.14 26.08,22.33 24.5,20.75 24.5,20 23,18.5 v23,17.5
  Bottom 0.254: v23,17.5 23,17 22,16 14.5,16 v14.21,15.71
GATE_OUT  (via drill 0.5)
  Top 0.254: U8.58 32.27,29.77 v33.04,27.91 | v14.49,30.28 14.29,30.41 10,35.5 6.5,35.5 4,38 4,38.47 2.75,39.72 2.75,39.99 2.34,40.4 R9.2
  Route15 0.254: v33.04,27.91 32.19,26.9 32.04,26.75 25.65,26.65 23.87,28.13 16.84,28.13 v14.49,30.28
GND  (via drill 0.5)
  Top 0.25: C10.2 44.8,94.95 45.5,95.65 | 40.05,13.55 v40.05,17.15
  Top 0.254: U8.20 30.79,19.85 30.79,18.18 31.04,17.41 C22.1 v31.09,15.05 31.28,15.04 v31.09,15.04 31.18,15 32.75,15 33.16,15.36 | C27.1 46.42,19.33 v46.37,19.29 | C13.2 v41.58,34.85 v41.57,34.84 | C12.1 43.34,37.92 43.34,36.16 43.75,35.75 43.75,34.75 | v44.83,36.67 44.83,37.3 44.08,38.05 43.23,38.05 C12.1 | C12.1 43.22,38.77 43.86,39.41 U4.2 U4.4 | C16.1 20.02,15.22 v19.5,14.5 18.5,13.5 18.04,13.5 U7.4 | v5.5,14 6.54,14.04 C17.1 7.07,15.5 11,15.5 11.56,14.94 U6.4 | R30.1 v22.49,5.51 v22.5,5.5 | C21.1 21.04,39.76 21.25,39.75 v21.04,39.74 v21.04,39.73 | C20.1 17.82,39.37 17.5,39 ENCODER.E | C19.1 23.28,21.7 | 23.28,21.7 23.29,22.01 | U3.4 45.5,104.49 45.5,104 45.61,103.89 U3.2 45.61,95.76 45.5,95.65 47.23,95.65 C11.2 | GND_CONNECT.1 34.81,69.03 C8.1 | C8.1 35.26,68.05 35.37,67.79 38.36,67.79 v39.35,66.8 39.05,66.5 37.5,66.5 37.23,66.22 U2.15 U2.14 U2.13 | C8.1 35.26,69.95 34.57,70.94 C9.2 | 23.28,21.7 23.28,21.73 v23.29,21.79 | U8.41 40.45,25.33 v41.45,26.08 41.75,26.71 42.83,28.04 43,28.09 | 43,28.09 48.78,28.09 49.24,27.63 49.24,23.77 | 49.24,23.77 49.24,21.3 48.57,20.63 43.77,20.68 42.15,21.87 42.15,22.25 | 42.15,22.25 41.75,23.25 41,23.75 40.73,23.86 | 49.14,23.87 49.24,23.77 | v26.42,34.85 26.31,34.84 C23.1 26.33,33.5 27,33.5 27.17,33.33 27.17,33.15 27.5,32.82 TO_SENSOR.10 | C24.1 34.39,36 | 34.39,36 34.39,36.19 34.41,36.21 | v34.43,36.51 34.43,36.34 34.39,36 | C18.1 23.79,25.26 v23.8,25.15 24.22,24.83 U8.9 | U8.25 33.27,17.27 C25.1 33.16,15.36 | C26.1 36.4,15.65 35.67,15.32 | 35.67,15.32 35.7,15.35 33.22,15.35 33.16,15.36 | USB.5 40.78,12.72 40.05,13.55 | C30.1 37,14 35.67,15.32
  Top 0.254: C28.2 43.1,27.99 43,28.09 | C29.2 41.88,22.93 42.15,22.25
  Bottom 0.254: EXP1.1 43.92,37.58 v44.83,36.67 | POWER.P$12 43.58,66.8 44.2,66.92 | 44.2,66.92 46.42,66.92 46.5,67 46.8,67 | 46.8,67 POWER.P$11 POWER.P$13 | POWER.P$14 POWER.P$12 | v39.35,66.8 39.35,66.85 40.04,66.8 POWER.P$12 | POWER.P$12 POWER.P$10 | 46.8,67 46.8,69.14 POWER.P$9 47.64,69.98 48.22,69.98 49.29,71.05 49.29,81.85 44.76,87.24 v44.76,91.37 | 44.2,66.92 43.69,66.92 v44.18,66.91 | EXP2.1 43.92,23.2 46.36,20.76 46.36,20.11 v46.37,19.29 | v23.8,25.15 23.8,22.33 v23.29,21.79
  other vias: 44.5,105 45.75,104.25 46.75,105 34.5,105.75 36.5,105.75 38.5,105.75 40.75,105.75 40.75,103.75 40.75,101 38.5,103.75 35.25,103.75 42.75,47.5 44,47.5 45.25,47.5
  pour Route2: 0.59,1 49,1 49,50.5 25.5,50.5 25.5,43 0.5,43
  pour Route2: 44.5,106.5 49,106.5 49,40 44.5,40
  pour Top: 33,106.5 49.75,106.5 49.75,97 33,97
  pour Bottom: 0.5,106.5 49.5,106.75 49.75,93 0.5,92.5
  pour Top: 41.8,54.2 48.8,54.2 49,40.75 42,40.75
  pour Bottom: 41.85,54.2 48.85,54.2 49,40.75 42,40.75
HOLD  (via drill 0.5)
  Top 0.254: v40.22,60.25 41.51,60.25 T2.3 R6.1 | U8.55 33.77,29.13 34.1,28.8 34.1,28.2 35.4,26.9 36.4,26.9 v36.5,27
  Bottom 0.254: v36.5,27 36.5,27.06 37.64,28.2 37.64,41.05 39.06,42.47 39.06,45.21 40.48,46.63 40.48,59.99 v40.22,60.25
I2C1_SCL
  Top 0.254: U8.44 39.72,26.83 40.96,28.27 40.96,32.74 39.75,33.8 39.75,47 39,48 33.5,48 33,47.5 28.5,47.5 27,46 27,43.5 27.5,43 28.66,43 TO_SENSOR.2
I2C1_SDA  (via drill 0.5)
  Top 0.254: U8.43 39.93,26.33 41.5,28 41.5,33 40.25,34 40.25,47.6 39.05,48.7 35.11,48.71 35.06,48.94 v35,48.8 | v34.5,43 32.34,43 TO_SENSOR.19
  Bottom 0.254: v35,48.8 35,43.5 v34.5,43
I2C2_SCL  (via drill 0.5)
  Top 0.254: U8.32 36.77,21.23 v36,22 | v48.99,39.27 48.99,32.55 48,32 43.9,32 v42.91,29.8
  Bottom 0.203: v36,22 41.3,22 44.32,18.53 46.79,18.52 48.84,19.73 48.84,24.8
  Bottom 0.254: 48.84,24.8 48.84,28.08 48.37,28.55 EXP2.2 47.2,28.53 43.9,28.53 43.88,28.55 42.74,28.55 42.71,28.86 v42.91,29.8 | EXP1.2 48.32,40.68 49,40 49,39.72 v48.99,39.27
I2C2_SDA  (via drill 0.5)
  Top 0.254: v35.6,20.9 35.85,20.9 36.25,20.5 36.25,19.4 U8.31
  Bottom 0.203: 47.68,17.99 48.63,18.45 49.42,19.63
  Bottom 0.254: 49.42,19.63 49.42,21.6 49.41,23.47 49.41,29.08 48.55,29.94 44.41,29.94 43.92,30.43 EXP2.3 42.81,31.09 42.4,32.9 42.4,42.59 42.64,43.23 EXP1.3 | 47.68,17.99 38.51,17.99 v35.6,20.9
JACK_DETECT  (via drill 0.5)
  Top 0.254: U8.42 40.08,25.83 42,27.75 42,33.25 40.75,34.5 40.75,56 38,58.75 38,62 39.5,63.5 39.5,65.25 39.25,65.5 v37.7,65.5 | v33.7,70.5 32.85,70.5 R41.1
  Bottom 0.254: v37.7,65.5 37.7,66.5 v33.7,70.5
LDAC  (via drill 0.5)
  Top 0.254: U8.2 26.42,28.33 24.35,30.4 24.3,46.3 26.5,48.5 26.5,52 27,53 27,53.4 v27.1,53.25 | v34,66.75 35.45,66.75 35.6,66.9 36.28,66.9 U2.16
  Bottom 0.254: v27.1,53.25 27.1,62.1 29.5,64.5 31.75,64.5 v34,66.75
LED_PWM_1  (via drill 0.5)
  Top 0.254: U8.49 36.77,38.73 36,39.5 v35,39.5 | v30.47,38.5 29.79,39.18 TO_SENSOR.5
  Bottom 0.254: v35,39.5 31.47,39.5 v30.47,38.5
LED_PWM_2
  Top 0.254: 32.37,39.13 TO_SENSOR.16 33.61,39.17 34,39.56 34,40 34.5,40.5 36,40.5 38,38.5 38,32.5 38.72,31.78 U8.48
LED_PWM_3  (via drill 0.5)
  Top 0.254: U8.51 35.77,37.99 35.72,38.04 35.13,38.04 v34.96,38.18 | v26.45,37.4 28.46,37.73 28.55,37.89 28.66,37.89 TO_SENSOR.6
  Bottom 0.254: v34.96,38.18 32.48,38.28 31.5,37 27.5,37 v26.45,37.4
LED_PWM_4
  Top 0.254: U8.52 35.26,36.98 35.24,37.29 34.2,37.48 33.48,37.9 TO_SENSOR.15
LED_PWM_5  (via drill 0.5)
  Top 0.254: U8.53 34.77,28.73 v35,28.5 | v26.45,36.15 27.24,36.5 27.35,36.61 28.66,36.61 TO_SENSOR.7
  Bottom 0.254: v35,28.5 35,34.5 34,35.5 27.5,35.5 v26.45,36.15
LOOP_SYNC  (via drill 0.5)
  Top 0.254: U8.61 30.76,28.85 v30.36,28.26 | R10.2 5.06,29.06 5.12,29 15,29 15.7,29.9 20.7,29.9 21.12,29.28 v21.68,29.28
  Route15 0.254: v30.36,28.26 30.05,27.25 25.85,27.25 24.25,28.75 22.21,28.75 v21.68,29.28
MCLR  (via drill 0.5)
  Top 0.254: R42.2 26,14.54 ICSP.6 | R34.1 23.81,28.19 23.45,28.45 21.7,28.45 21,27.75 21,23 20.5,22.5 20.5,20.25 v21.95,18.5
  Route15 0.254: v21.95,18.5 23.25,18.5 24.25,17.5 24.25,16.29 ICSP.6
MGC3130_IRQ  (via drill 0.5)
  Top 0.254: U8.46 39.93,27.83 40.4,28.5 40.4,32.5 39.25,33.5 39.25,46 38.5,47 v36,47 | v34.77,41.7 TO_SENSOR.18
  Bottom 0.254: v36,47 36,42.93 v34.77,41.7
MGC3130_RESET  (via drill 0.5)
  Top 0.254: U8.47 39.66,28.33 39.9,28.77 39.9,32 38.75,33 38.75,45.5 38.5,46 v30.5,46 | v30.41,41.72 TO_SENSOR.3
  Bottom 0.254: v30.5,46 30.5,42.63 v30.41,41.72
N$1
  Top 0.254: T3.3 3.15,27.6 2.25,28.5 2.25,28.91 R10.1 2.07,31.2 2.72,32.97 2.72,34.45 R8.1
N$2
  Top 0.254: IC1.2 29.1,85.75 C7.2 | C7.2 26.53,86.1 R23.1 | C7.2 28.95,84.42 R20.1
N$3  (via drill 0.5)
  Top 0.254: IC1.10 36.56,81.94 v35,83.5 | v24.75,83.25 25.75,84.25 26.41,84.25 R13.2
  Bottom 0.254: v35,83.5 33,85.5 29,85.5 27.75,84.25 25.75,84.25 v24.75,83.25
N$4
  Top 0.254: IC1.1 30.48,87.02 30,87.5 29.05,87.5 C7.1 | C7.1 28.95,89.07 R27.1 | C7.1 26.48,87.4 R23.2
N$5
  Top 0.254: R5.2 2.7,21.15 2,22 1.57,22 1.47,22.3 1.47,22.9 R1.1 1.47,23.54 2.19,24.25 T3.1
N$6  (via drill 0.5)
  Top 0.254: R1.2 2.76,23.96 v3.5,24.5
  Bottom 0.203: 3.5,34.5 3.5,34 3,33.5 3,25 v3.5,24.5
  Bottom 0.254: 3.5,34.5 6.5,37.5 JACK1.3
N$7  (via drill 0.5)
  Top 0.254: IC1.5 v34.26,81.94 v34.27,81.95 | v32,66 31.85,66 31.64,66.21 30.52,66.21 U2.2
  Bottom 0.254: v34.27,81.95 31.95,81.95 31,81 31,69.5 31.5,69 31.5,67.5 32,67 v32,66
N$8
  Top 0.254: JACK4.3 19,50.5 22,53.5 22,58 24.5,60.5 25.78,60.5 R11.1
N$9
  Top 0.254: T4.1 27.42,60.62 R11.2
N$10
  Top 0.254: 40.3,80.7 R16.2 37.7,80.7 37.7,79.34 IC1.8 IC1.9
N$11
  Top 0.254: R24.2 C6.2 27.67,80.8 28.15,81.28 30.46,81.28 31.07,80.67 IC1.6 32.47,80.7 34,80.7 36.18,78.52 R21.2
N$12
  Top 0.25: T1.3 5.03,42.28 4.75,42 4.17,42 R7.1
  Top 0.254: R9.1 R7.1
N$13  (via drill 0.5)
  Top 0.254: R4.2 1.73,36.92 v2.77,36.08 | v7.9,40.2 7.9,41.3 T1.1 8.06,41.37 R2.1
  Route15 0.254: v2.77,36.08 3.78,36.08 v7.9,40.2
N$14
  Top 0.254: R2.2 9.59,47.41 7.5,49.5 7.5,51 9.5,53 9.5,54.85 JACK2.3
N$15
  Top 0.254: IC1.7 31.13,79.4 30.19,80.34 29.38,80.34 C6.1 R24.1 29.17,74.71 R25.1
N$16
  Top 0.254: R3.2 42.13,64.37 42.5,64 42.5,62.79 T2.1
N$17
  Top 0.254: R34.2 22.51,26.43 C18.2 R32.1
N$18  (via drill 0.5)
  Top 0.254: R3.1 40.79,66.96 39.43,67.76 39.44,69.45 v38.61,70.24 | v31.95,73.21 25.21,73.21 22.5,70.5 19.15,70.5 JACK3.3
  Bottom 0.254: v38.61,70.24 37.02,70.25 v31.95,73.21
N$19
  Top 0.254: C5.2 35.55,87.26 36.22,85.76 IC1.13 37.61,85.83 R22.1 42,86.34 R19.1
N$20  (via drill 0.5)
  Top 0.254: R36.1 11.3,42.48 11.3,43.08 11.5,43.25 20.27,43.24 20.76,42.78 C21.2 21.26,42.76 21.86,42.76 22,42.12 22,39.5 21.6,38.2 v21.6,35.5 | U8.64 28.78,30.78 28,30 26.7,30 v26.2,30.7
  Route15 0.254: v26.2,30.7 25.1,30.9 22.75,35.5 v21.6,35.5
  Bottom 0.254: ENCODER.B 14.75,21.5 17.5,24.25 17.5,25.75 13.5,29.75 13.5,31.5 16.75,35 21.35,35 v21.6,35.5
N$21
  Top 0.254: R22.2 40.33,87.13 39.5,87 37.66,87 IC1.14 37.64,88.73 R26.1 37.26,88.74 36.5,89.5 36.5,90 36,90.5 C5.1
N$22
  Top 0.254: R39.2 R41.2 32.55,72 33,72 33.1,72.1 33.1,73.6 32.25,74 31.5,74 31.25,73.75 25,73.75 24.25,73 18.25,73 16.5,71.25 16.5,68.25 18.7,66.05 JACK5.2
N$23  (via drill 0.5)
  Top 0.254: IC1.3 30.52,84.48 v30.5,84.5 | v30.5,68 U2.1
  Bottom 0.254: v30.5,84.5 v30.5,68
N$24  (via drill 0.5)
  Top 0.254: U1.2 37,55.52 | 37,55.52 37.98,55.52 38.5,55 D1.3 | v43.68,64.81 42.06,65.63 42.06,70.7 40.3,70.7 v39.25,71.75 | v37.5,56.5 37.5,56.02 37,55.52 | v39.5,78.35 40.28,78.75 R16.1
  Route15 0.254: v37.5,56.5 38,56 43,56 43.68,56.68 43.68,58.32 42.5,59.5 42.5,63.63 v43.68,64.81
  Bottom 0.254: v39.25,71.75 39.25,78.25 v39.5,78.35
N$25  (via drill 0.5)
  Top 0.254: R27.2 28.41,90.63 v27,90 | v23,96.5 22.5,96.5 20.5,98.5 17.5,98.5 14.5,95.5 6.65,95.5 JACK8.3
  Route15 0.254: v27,90 26,90 23,93 v23,96.5
N$26  (via drill 0.5)
  Top 0.254: R13.1 26.16,82.66 25.5,82 25.5,75.43 v26.4,74.75 | JACK5.3 19,62 21,64 21,64.5 26.31,69.81 v26.45,69.81 25.91,70.35 R40.1
  Bottom 0.254: v26.4,74.75 26.38,73.66 27.97,72.07 27.97,71.33 v26.45,69.81
N$29  (via drill 0.5)
  Top 0.254: 19.33,40.25 C20.2 | U8.63 29.77,29.77 v28.93,29.23 | v20,36 20,38.2 19.13,38.87 C20.2 | C20.2 R33.1
  Route15 0.254: v20,36 17.75,36 15,33.25 15,31 17.25,28.85 19.55,28.85 v19.6,29 21.1,30.1 22.4,30.1 23.25,29.25 24.5,29.25 25.5,28.25 28,28.25 28.93,29.18 v28.93,29.23
  Bottom 0.254: ENCODER.A 7.75,26.75 17,36 v20,36
N$30
  Top 0.254: R14.1 25.77,97.77 23,95 19.35,95 JACK6.3
N$31  (via drill 0.5)
  Top 0.254: R25.2 27.78,75.52 v27.5,76
  Route15 0.254: v27.5,76 26.5,76 24.5,78 22,78 20,76 17.5,76 v16.5,77
  Bottom 0.254: v16.5,77 16,77 11.5,81.5 11.5,81.52 10.08,82.94 6.59,82.94 JACK9.3
N$32
  Top 0.254: R14.2 25.83,105.64 27.69,105.64 T5.1
N$33  (via drill 0.5)
  Top 0.254: U8.27 34.27,21.73 v34,22
  Route15 0.254: v34,22 30,22 29,21 20.75,21 18.5,23.25 14.5,23.25 14,23.5 14,23.75 POT.2
N$34  (via drill 0.5)
  Top 0.254: IC1.12 38.98,84.48 v39.64,84.82 | v32.5,63 30.54,63 U2.7
  Route15 0.254: v39.64,84.82 38.5,84.82 37,83.5 37,75.5 35.5,74 35.5,66 v32.5,63
N$35  (via drill 0.5)
  Top 0.254: U8.18 29.77,18.27 v27.46,16.41 | v21.15,2.18 SWITCH.3
  Bottom 0.254: v27.46,16.41 26,16.41 24,14.5 24,5.03 v21.15,2.18
N$38  (via drill 0.5)
  Top 0.254: R26.2 37.88,91.12 v37,92 | v17.5,86 17.5,85.67 8.01,76.18 8.01,75.65 6.46,74.1 6.46,70.39 JACK10.3
  Route15 0.203: 26,89 28,89 28.5,89.5 28.5,90.5 v27.5,91.5
  Route15 0.254: 26,89 24.5,90.5 22.5,90.5 21,89 20.5,89 v17.5,86
  Bottom 0.254: v37,92 28,92 v27.5,91.5
N$39
  Top 0.254: R15.1 25.58,93.58 19,87 JACK7.3
N$40
  Top 0.254: R15.2 25.95,95.95 26.75,96.75 30.25,96.75 30.5,96.5 T6.1
N$41
  Top 0.25: 41.98,24.83 42.08,24.83 42.5,25.25 43.05,25.25 C28.1
  Top 0.254: U8.40 41.98,24.83 | C28.1 45,25.25 45.25,25.5 45.25,26.5 CRYSTAL.3
N$42  (via drill 0.5)
  Top 0.254: v44.5,80.5 44.5,81.98 F1.1
  Bottom 0.254: POWER.P$7 44.52,71.88 44.3,72.1 | 44.3,72.1 44.3,80.3 v44.5,80.5 | POWER.P$8 44.08,71.88 44.3,72.1
N$43
  Top 0.254: U8.39 42.17,24.33 42.25,24.35 42.84,24.35 C29.1 46.82,24.23 47.75,23.25 47.75,22.22 CRYSTAL.1
N$44  (via drill 0.5)
  Top 0.254: v48.5,80.98 48,81 47.5,81.5 47.5,82.08 F2.1
  Route2 0.254: v49,62 48.07,67.27 48,69 48,69.5 49,70.5 49,80.5 v48.5,80.98
  Bottom 0.254: v49,62 48.72,61.72 POWER.P$15 42.22,61.72 42,61.5 41.76,61.5 POWER.P$16
N$45
  Top 0.254: U8.34 39.67,21.83 39.85,21.45 39.85,20.2 38.1,18.45 38.1,12.1 37.75,11.75 C30.2 37,10.75 38.23,9.52 USB.1
N$46
  Top 0.254: C24.2 34.39,32.68 33.7,31.99 33.41,31.99 33.27,31.85 U8.56
N$51
  Top 0.254: R31.2 20.88,8.88 20.5,8.5 7.81,8.5 SWITCH.2
PGEC
  Top 0.254: U8.15 26.39,21.82 26.05,21.5 25.04,19.8 23.91,18.22 23.91,6.47 ICSP.2
PGED
  Top 0.254: U8.16 27.32,20.68 24.54,17.9 24.54,8.38 ICSP.3
RAM_SS  (via drill 0.5)
  Top 0.203: U8.21 31.27,18.44 v32.12,17.89 | v13.5,10 9.55,10 7.75,11.8 U6.1
  Route2 0.203: v32.12,17.89 29.57,17.89 28.98,17.24 26.77,17.24 25.43,15.96 25.43,15.93 24,14.5 24,11.5 22,9.5 14,9.5 v13.5,10
RECORD_IN  (via drill 0.5)
  Top 0.25: 25.12,38.77 25.12,39.13 24.8,39.5 24.8,44.55 v25.1,44.9
  Top 0.254: 27.27,100.88 R17.1 | U8.62 30.27,29.49 v29.13,28.05 | v27.5,99 27.5,100.65 R17.1 | v25.17,38.77 25.12,38.77 25.1,38.75 | R17.1 27.49,101.49 28.25,102.25 29,102.25 30,103.25 30,104.5 T5.3
  Bottom 0.254: v29.13,28.05 27.02,28.05 25.13,30.34 25.13,33.12 24.75,33.5 24.75,38.35 v25.17,38.77 | v25.1,44.9 21,49 21,52 22,53 22,59.5 20.5,61 20.5,64.5 22,66 22,72 20.5,73.5 20.5,76.5 22,78 22,84.5 20.5,86 20.5,88.5 22,90 22,93.5 v27.5,99
RESET
  Top 0.254: R42.1 26,17.75 30,21.75 30,25 29.25,25.85 27.4,25.85 U8.7
SPI1_CLK  (via drill 0.5)
  Top 0.254: U8.50 36.27,29.63 v36.11,29.07 | v33.25,54.75 32.5,55.5 30.85,55.5 U1.7 | U2.10 35.48,62.98 v33.5,61
  Bottom 0.254: v36.11,29.07 36.14,41.75 38,43.5 38,46 39.5,47.5 39.5,49 39,49.5 36.75,49.5 35.25,51 35.25,52.75 v33.25,54.75 33.5,55 v33.5,61
SPI1_MISO  (via drill 0.5)
  Top 0.254: v28.75,49.5 30,49.5 v31,50.5 | v29,56.5 29.5,56.5 29.75,56.75 30.8,56.75 U1.6 | U8.1 26.92,28.83 25,30.75 25,37.35 26,38.25 27.1,38.25 27.25,38.5 27.25,39.5 25.9,40.3 25.9,42.2 v26.2,42.5
  Bottom 0.254: v28.75,49.5 28.5,49.25 28,49.25 26,47.25 26,44.25 26.5,43.75 v26.2,42.5 | v31,50.5 30.5,50.5 29.25,51.75 29.25,55.75 v29,56.5
SPI1_MOSI
  Top 0.254: 36.33,63.64 U2.11 37.17,63.62 37.5,63.29 37.5,61.5 35.5,59.5 34,59.5 33.5,59 28.75,59 28.25,58.5 28.25,57.5 27.6,56.25 27.6,56 25.5,53.75 25.5,49.25 23.22,47.21 23.19,29.85 24.9,28.4 25.3,28 26.44,26.81 U8.5
SPI2_MISO  (via drill 0.5)
  Top 0.254: U6.2 9.03,11.97 9.5,11.5 15,11.5 15.25,11.75 | 15.25,11.75 15.5,12 15.5,13.49 U7.2 | v15.5,10.5 15.5,11.5 15.25,11.75 | U8.13 28.42,22.83 v29,22.25
  Bottom 0.254: v15.5,10.5 18,10.5 20.04,12.54 20.04,13.23 29,22.19 v29,22.25
SPI2_MOSI  (via drill 0.5)
  Top 0.254: v20,19.5 18.19,19.5 18.04,19.35 18.04,18.77 U7.5 | U6.5 11.56,17.43 v12,16.74 | U8.6 29.62,26.33 v31,24.5
  Bottom 0.254: v12,16.74 12,17.5 14,19.5 v20,19.5 21.25,20.75 24,20.75 26.5,23.25 29.25,23.25 30.5,24.5 v31,24.5
SPI2_SCK  (via drill 0.5)
  Top 0.254: v19.5,27 19.5,21.14 18.62,20.26 17.02,20.26 16.81,20.05 | 16.81,20.05 16.73,19.97 U7.6 | U6.6 10.29,19.95 10.57,20.23 16.63,20.23 16.81,20.05 | U8.4 28.17,27.33 28.6,27.35 31.02,26.3 v31.94,25.58
  Route15 0.254: v19.5,27 19.5,26.75 22,24.25 27.5,24.25 28.75,25.5 29.45,25.5 30.25,26.2 31.22,26.2 v31.94,25.58
SR_CLK  (via drill 0.5)
  Top 0.254: TO_SENSOR.17 31.11,40.44 v30.48,39.81 | v29,24.5 29,24.09 28.24,23.33 U8.12
  Bottom 0.254: v30.48,39.81 27.4,39.81 26.99,40.15 24.9,40.15 24,38.5 24,30.26 24.39,29.86 26.75,27.5 26.75,27.25 29,25 v29,24.5
SR_DATA  (via drill 0.5)
  Top 0.254: U8.11 26.08,23.83 v24.95,23.25 | v26.75,41 27.25,40.5 28.61,40.5 TO_SENSOR.4
  Bottom 0.254: v24.95,23.25 24.95,25.15 25.75,25.75 25.75,27.5 23.5,29.75 23.5,39 24.7,41 v26.75,41
SWITCH_INPUT  (via drill 0.5)
  Top 0.254: U8.45 37.8,27.33 37.51,27.17 37.5,26 36,24.5 33,24.5 v31.5,23 | SWITCH.4 14.4,2.19 19.41,7.2 20.91,7.2 R30.2 21,7.29 21,8 21.5,8.5 v22,8.5
  Bottom 0.254: v31.5,23 27.5,19 26.7,19 24.72,17.02 24.72,17.01 22.38,14.67 22.17,14.67 21.5,14 21.5,9 v22,8.5
SWITCH_LED1  (via drill 0.5)
  Top 0.254: U8.17 29.27,19.77 v27.5,18 | v22.51,13.78 20.9,13.78 R31.1
  Bottom 0.254: v27.5,18 26.6,18 v22.51,13.78
SYNC_IN  (via drill 0.5)
  Top 0.254: R18.1 32.23,93.14 T6.3 29.4,93 v27.5,93 | U8.59 31.77,29.43 32,28 32.4,27.2 v33.1,26 | v27.5,50.5 27,50 27,47.5 26,46.1 26,44 25.35,43.7 25.35,39.85 25.4,39.7 v26.3,39.1
  Bottom 0.254: v33.1,26 33.5,26.5 34,27 34,34 33.5,34.5 27.5,34.5 27,34 25.5,34 25.55,34.4 25.55,37.65 v26.3,39.1 | v27.5,50.5 26.5,50.5 23.5,53.5 23.5,59.5 25.5,61.5 25.5,76.5 23.5,78.5 23.5,83.5 26.5,86.5 26.5,88.5 26,89 26,91.5 v27.5,93
VCC  (via drill 0.5)
  Top 0.25: C10.1 43,95.71 43.3,96.01 | 43,91 43,90.25 44.75,88.5 44.75,84.9 F1.2
  Top 0.254: C12.2 41.52,40.85 U4.1 41.55,41.8 41.55,45 41.55,56.15 v47.5,58.5 | 44.97,85.07 F1.2 44.46,84.82 43.44,84.82 43.38,84.04 43.33,76.29 | U3.1 43.3,96.01 | IC1.4 32.47,83.24 33.96,83.24 34,83.28 34,87.5 33.5,88 32.5,88 31.65,88.85 C4.2 31.68,89.24 31.68,90.97 32.71,92 35.5,92 36.51,93.01 41.51,93.01 42.25,93.75 42.99,93.75 C10.1 | 43.33,76.29 43.69,75.3 43.7,75.29 43.7,69.94 44.55,69.09 C14.2 44.52,68.56 v43.29,68.07 | R28.2 R29.2 43.29,76.25 43.33,76.29 | 42.94,93.82 C10.1 | C10.1 43,91
  Route15 0.254: v47.5,58.5 47.5,66.5 45.5,68.5 43.41,68.5 v43.29,68.07
VEE  (via drill 0.5)
  Top 0.254: F2.2 47.57,83.92 47.28,83.63 46.25,83.63 v46.23,83.65 | v39.47,83.65 39.47,83.51 39.17,83.21 IC1.11 36.29,83.21 36,83.5 36,85.05 34.97,87.25 33.77,89.19 33.31,89.2 C4.1
  Bottom 0.254: v46.23,83.65 v39.47,83.65